# Altium project x_pmu_project.PrjPcb
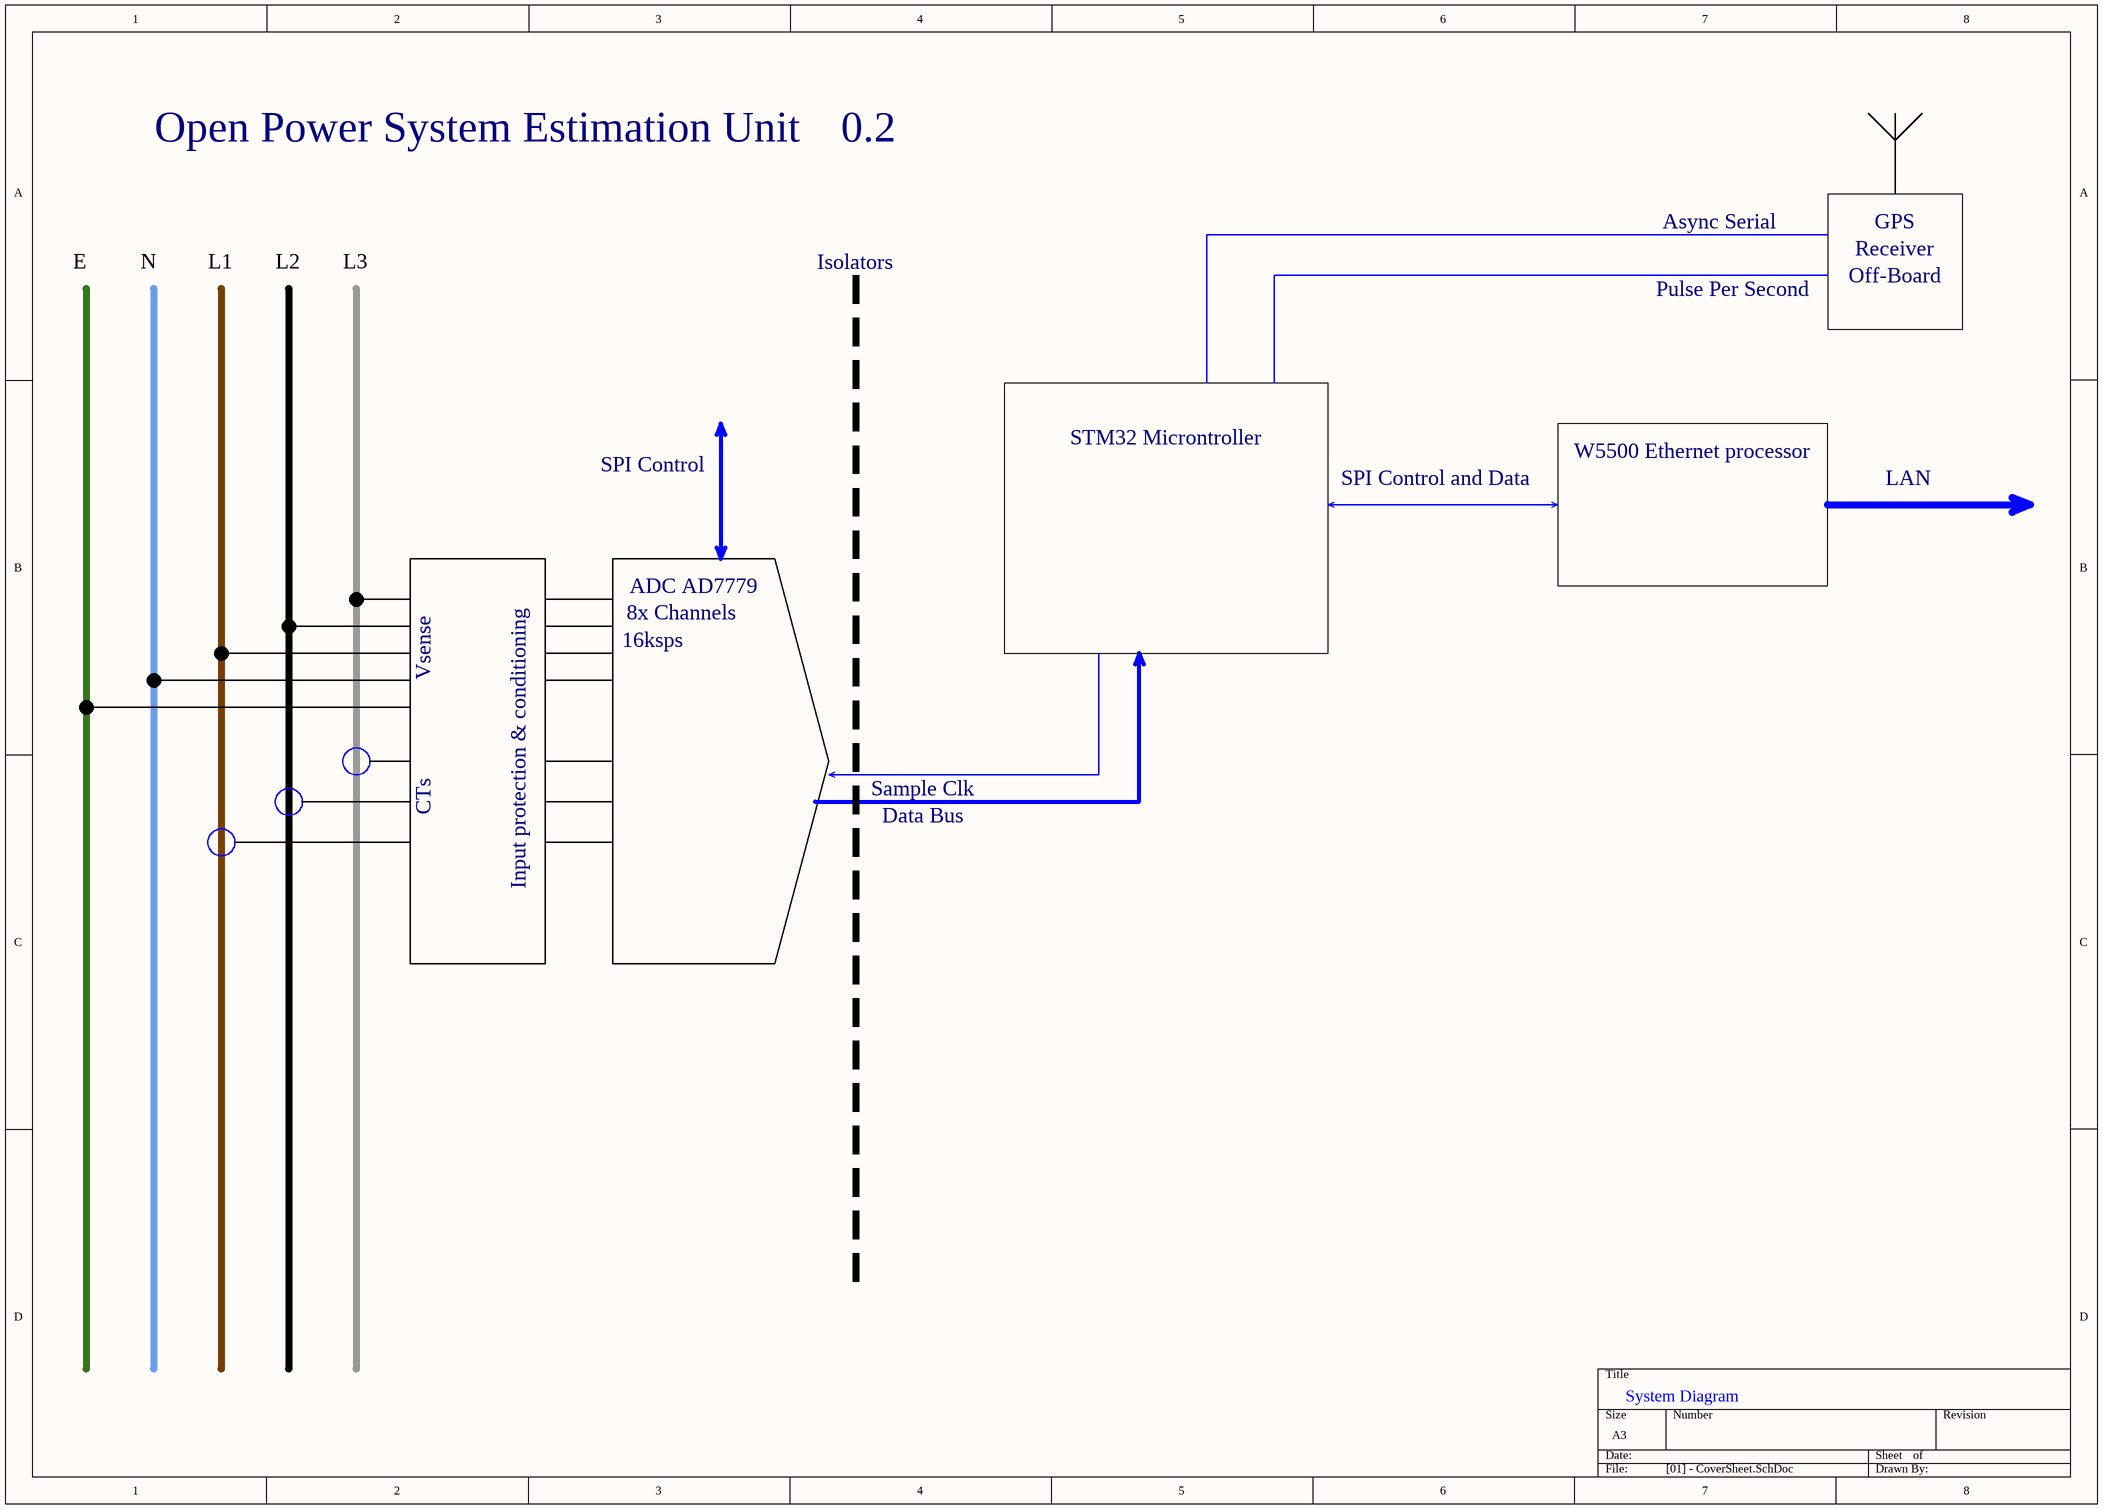
[diagram p0: [01] - CoverSheet.SchDoc]
ProjectName: xPMU
8 sheets, 226 parts. Net scope: flat (ports and power ports of the same name join across sheets).
Board file: x_pmu_board.pcbdoc
Sheets:
  [01] - CoverSheet.SchDoc
  [02] - Notes.SchDoc
  [03] - HV Input.SchDoc
  [04] - Current Transformers.SchDoc
  [05] - ADC.SchDoc
  [08] - Microcontroller.SchDoc
  [09] - Ethernet.SchDoc
  [10] - Isolation.SchDoc

## Sheet [01] - CoverSheet.SchDoc
size A3; Engineer: Derryn Harvie; Revision: 0.2; SheetNumber: 1

### Notes on the sheet
- Open Power System Estimation Unit
- Async Serial
- GPS
- Receiver
- E
- N
- L1
- L2
- L3
- Isolators
- Pulse Per Second
- Off-Board
- STM32 Microntroller
- W5500 Ethernet processor
- SPI Control
- SPI Control and Data
- LAN
- ADC AD7779
- 8x Channels
- 16ksps
- Vsense
- Input protection & conditioning
- Sample Clk
- CTs
- Data Bus
- System Diagram

## Sheet [02] - Notes.SchDoc
size A4
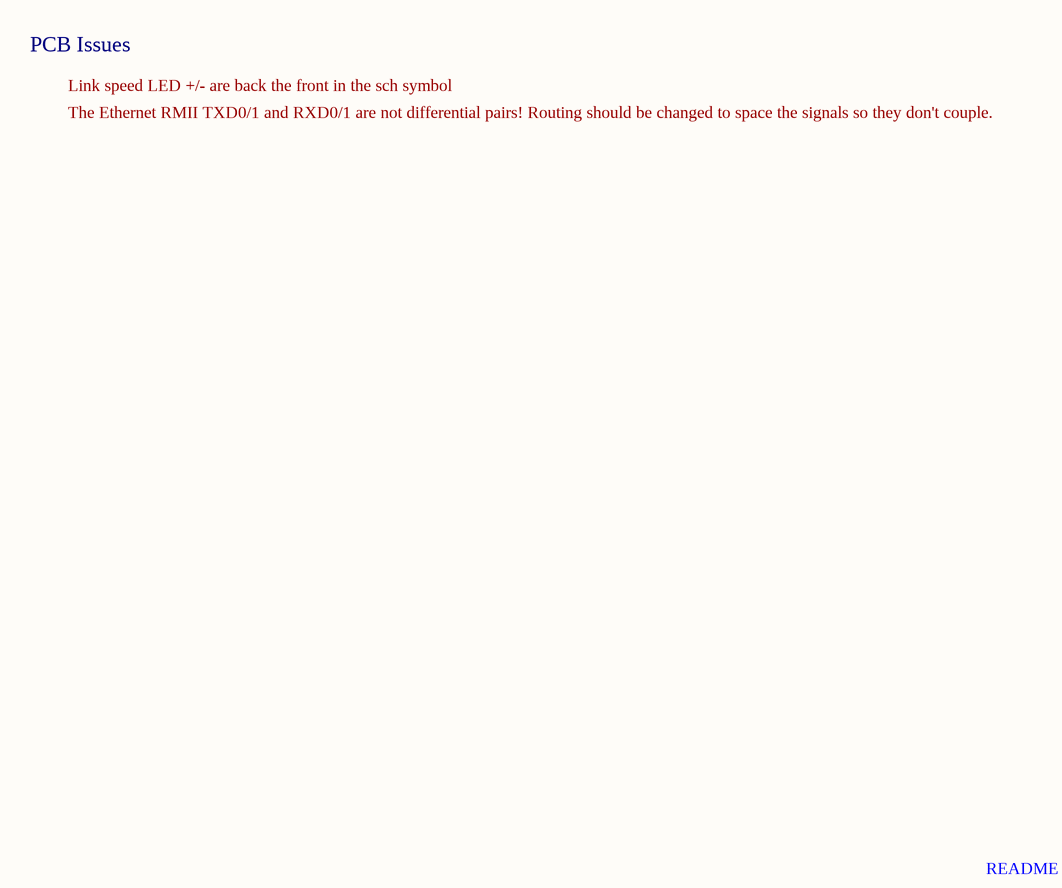
[diagram p1: [02] - Notes.SchDoc]

### Notes on the sheet
- PCB Issues
- Link speed LED +/- are back the front in the sch symbol
- The Ethernet RMII TXD0/1 and RXD0/1 are not differential pairs! Routing should be changed to space the signals so they don't couple.
- README

## Sheet [03] - HV Input.SchDoc
size A3
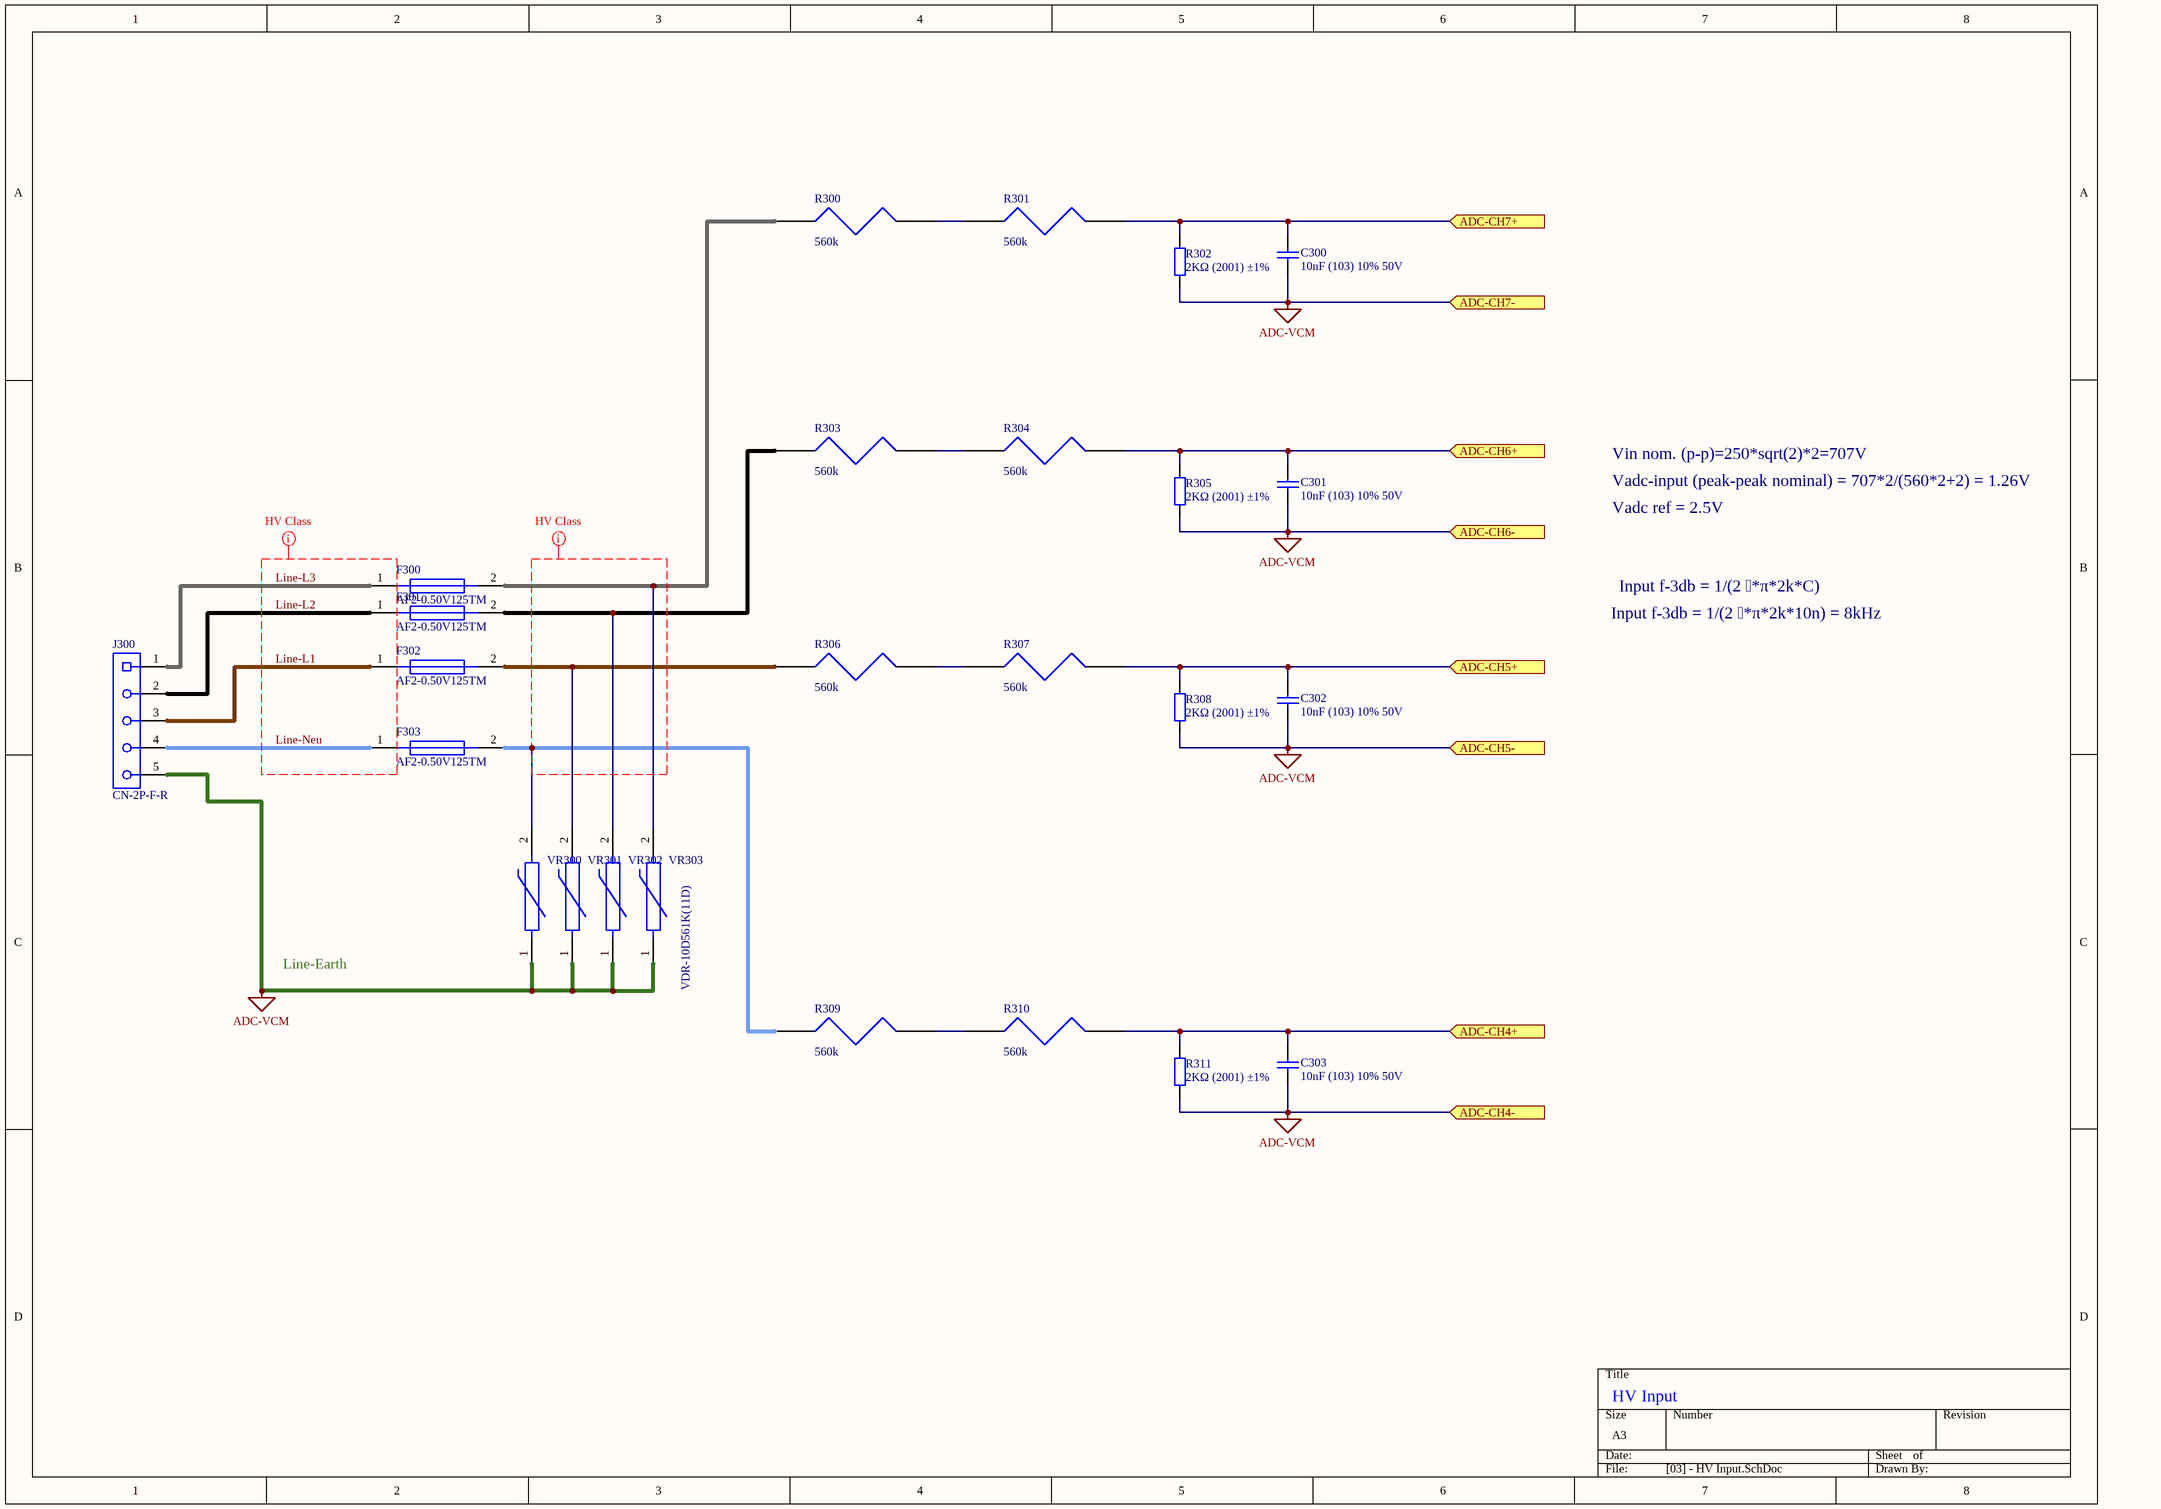
[diagram p2: [03] - HV Input.SchDoc]

### Parts
C300  10nF (103) 10% 50V  [0805_C]
C301  10nF (103) 10% 50V  [0805_C]
C302  10nF (103) 10% 50V  [0805_C]
C303  10nF (103) 10% 50V  [0805_C]
F300  AF2-0.50V125TM  [2410 Fuse]
F301  AF2-0.50V125TM  [2410 Fuse]
F302  AF2-0.50V125TM  [2410 Fuse]
F303  AF2-0.50V125TM  [2410 Fuse]
J300  CN-2P-F-R  [PHOE-1729128-2_V]
R300  560k  [2512_HV_RES]
R301  560k  [2512_HV_RES]
R302  2KΩ (2001) ±1%  [0805_R]
R303  560k  [2512_HV_RES]
R304  560k  [2512_HV_RES]
R305  2KΩ (2001) ±1%  [0805_R]
R306  560k  [2512_HV_RES]
R307  560k  [2512_HV_RES]
R308  2KΩ (2001) ±1%  [0805_R]
R309  560k  [2512_HV_RES]
R310  560k  [2512_HV_RES]
R311  2KΩ (2001) ±1%  [0805_R]
VR300  VDR-10D561K(11D)  [VDR-10D561K(11D)]  (value not drawn)
VR301  VDR-10D561K(11D)  [VDR-10D561K(11D)]  (value not drawn)
VR302  VDR-10D561K(11D)  [VDR-10D561K(11D)]  (value not drawn)
VR303  VDR-10D561K(11D)  [VDR-10D561K(11D)]

### Ports
ADC-CH4+ (in), ADC-CH4- (in), ADC-CH5+ (in), ADC-CH5- (in), ADC-CH6+ (in), ADC-CH6- (in), ADC-CH7+ (in), ADC-CH7- (in)

### Nets
ADC-VCM: C300.1 C301.1 C302.1 C303.1 J300.5 R302.1 R305.1 R308.1 R311.1 VR300.1 VR301.1 VR302.1 VR303.1 ; port ADC-CH4-, port ADC-CH5-, port ADC-CH6-, port ADC-CH7-
Line-L1: F302.1 J300.3
Line-L2: F301.1 J300.2
Line-L3: F300.1 J300.1
Line-Neu: F303.1 J300.4
NetC300_2: C300.2 R301.2 R302.2 ; port ADC-CH7+
NetC301_2: C301.2 R304.2 R305.2 ; port ADC-CH6+
NetC302_2: C302.2 R307.2 R308.2 ; port ADC-CH5+
NetC303_2: C303.2 R310.2 R311.2 ; port ADC-CH4+
NetF300_2: F300.2 R300.1 VR303.2
NetF301_2: F301.2 R303.1 VR302.2
NetF302_2: F302.2 R306.1 VR301.2
NetF303_2: F303.2 R309.1 VR300.2
NetR300_2: R300.2 R301.1
NetR303_2: R303.2 R304.1
NetR306_2: R306.2 R307.1
NetR309_2: R309.2 R310.1

### Layout directives
net class HV: (no net found under the mark), Line-L1, Line-L2, Line-L3, Line-Neu

### Notes on the sheet
- Vin nom. (p-p)=250*sqrt(2)*2=707V
- Vadc-input (peak-peak nominal) = 707*2/(560*2+2) = 1.26V
- Vadc ref = 2.5V
- Input f-3db = 1/(2 *π*2k*C)
- Input f-3db = 1/(2 *π*2k*10n) = 8kHz
- Line-Earth
- HV Input

### Library data of the parts
C300-C303 = 0805 10nF (103) 10% 50V: 贴片电容; ComponentLink1Description: 供应商链接; ComponentLink1URL: http://www.szlcsc.com/product/details_2062.html; Package: 0805; Supplier: LC; SuppliersPartNumber: C1710
F300-F303 = AF2-0.50V125TM: Chip Fuse Fast Blow 500mA 231mΩ 100A AC，50A DC 0.1 2410 Surface Mount Fuses RoHS; SuppliersPartNo: C311009; JLCPCB: NO
J300 = CN-2P-F-R: 5 Way - 10.16 block; JLCPCB: NO
R300 R301 R303 R304 R306 R307 R309 R310 = HR2512F560KE04Z: HIGH VOLTAGE RESISTOR 560KOHMS ±1% 1W 2512 ROHS; Value: 560k; Supplier: LCSC; SuppliersPartNumber: C175529
R302 R305 R308 R311 = 0805 2KΩ (2001) 1%: 贴片电阻; ComponentLink1Description: 供应商链接; ComponentLink1URL: http://www.szlcsc.com/product/details_18292.html; Package: 0805; Supplier: LC; SuppliersPartNumber: C17604
VR300-VR303 = VDR-10D561K(11D): 460V 920V 2.5KA 560V Through Hole Varistors RoHS; SuppliersPartNo: C283943; JLCPCB: NO

## Sheet [04] - Current Transformers.SchDoc
size A3
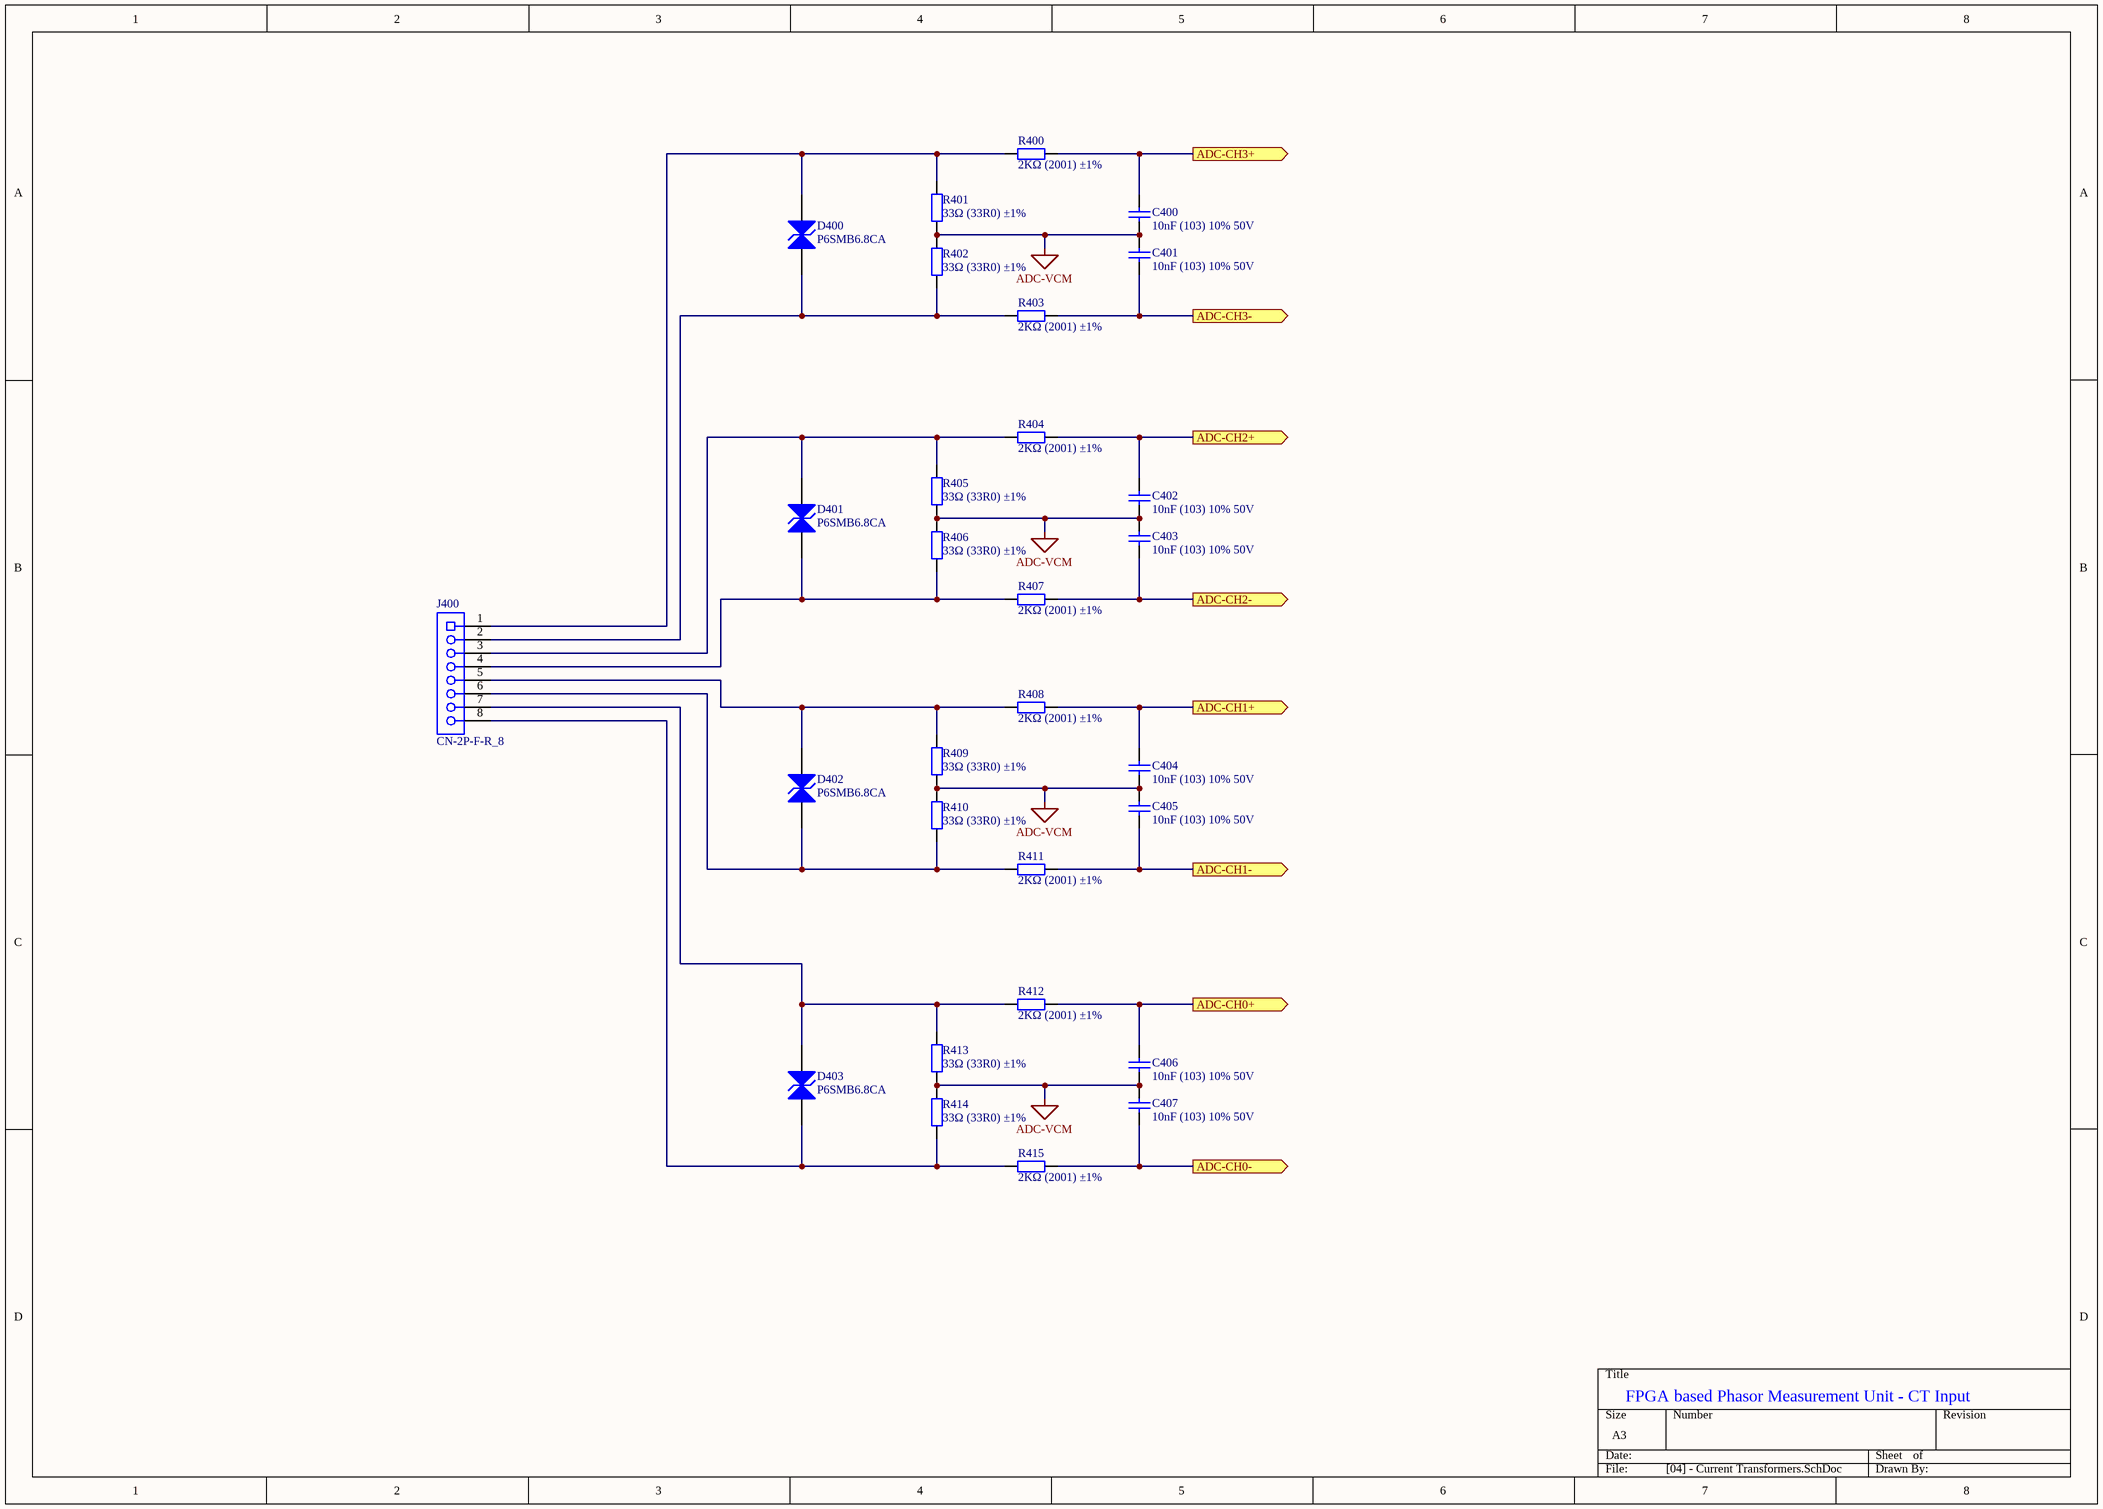
[diagram p3: [04] - Current Transformers.SchDoc]

### Parts
C400  10nF (103) 10% 50V  [0805_C]
C401  10nF (103) 10% 50V  [0805_C]
C402  10nF (103) 10% 50V  [0805_C]
C403  10nF (103) 10% 50V  [0805_C]
C404  10nF (103) 10% 50V  [0805_C]
C405  10nF (103) 10% 50V  [0805_C]
C406  10nF (103) 10% 50V  [0805_C]
C407  10nF (103) 10% 50V  [0805_C]
D400  P6SMB6.8CA  [SMB(DO-214AA)_S1]
D401  P6SMB6.8CA  [SMB(DO-214AA)_S1]
D402  P6SMB6.8CA  [SMB(DO-214AA)_S1]
D403  P6SMB6.8CA  [SMB(DO-214AA)_S1]
J400  CN-2P-F-R_8  [PHOE-8way]
R400  2KΩ (2001) ±1%  [0805_R]
R401  33Ω (33R0) ±1%  [0603_R]
R402  33Ω (33R0) ±1%  [0603_R]
R403  2KΩ (2001) ±1%  [0805_R]
R404  2KΩ (2001) ±1%  [0805_R]
R405  33Ω (33R0) ±1%  [0603_R]
R406  33Ω (33R0) ±1%  [0603_R]
R407  2KΩ (2001) ±1%  [0805_R]
R408  2KΩ (2001) ±1%  [0805_R]
R409  33Ω (33R0) ±1%  [0603_R]
R410  33Ω (33R0) ±1%  [0603_R]
R411  2KΩ (2001) ±1%  [0805_R]
R412  2KΩ (2001) ±1%  [0805_R]
R413  33Ω (33R0) ±1%  [0603_R]
R414  33Ω (33R0) ±1%  [0603_R]
R415  2KΩ (2001) ±1%  [0805_R]

### Ports
ADC-CH0+ (out), ADC-CH0- (out), ADC-CH1+ (out), ADC-CH1- (out), ADC-CH2+ (out), ADC-CH2- (out), ADC-CH3+ (out), ADC-CH3- (out)

### Nets
ADC-VCM: C400.1 C401.2 C402.1 C403.2 C404.1 C405.2 C406.1 C407.2 R401.1 R402.2 R405.1 R406.2 R409.1 R410.2 R413.1 R414.2
NetC400_2: C400.2 R400.1 ; port ADC-CH3+
NetC401_1: C401.1 R403.1 ; port ADC-CH3-
NetC402_2: C402.2 R404.1 ; port ADC-CH2+
NetC403_1: C403.1 R407.1 ; port ADC-CH2-
NetC404_2: C404.2 R408.1 ; port ADC-CH1+
NetC405_1: C405.1 R411.1 ; port ADC-CH1-
NetC406_2: C406.2 R412.1 ; port ADC-CH0+
NetC407_1: C407.1 R415.1 ; port ADC-CH0-
NetD400_1: D400.1(A) J400.2 R402.1 R403.2
NetD400_2: D400.2(K) J400.1 R400.2 R401.2
NetD401_1: D401.1(A) J400.4 R406.1 R407.2
NetD401_2: D401.2(K) J400.3 R404.2 R405.2
NetD402_1: D402.1(A) J400.6 R410.1 R411.2
NetD402_2: D402.2(K) J400.5 R408.2 R409.2
NetD403_1: D403.1(A) J400.8 R414.1 R415.2
NetD403_2: D403.2(K) J400.7 R412.2 R413.2

### Notes on the sheet
- FPGA based Phasor Measurement Unit - CT Input

### Library data of the parts
C400-C407 = 0805 10nF (103) 10% 50V: 贴片电容; ComponentLink1Description: 供应商链接; ComponentLink1URL: http://www.szlcsc.com/product/details_2062.html; Package: 0805; Supplier: LC; SuppliersPartNumber: C1710
D400-D403 = SMB/DO-214AA P6SMB6.8CA: TVS; ComponentLink1Description: 供应商链接; ComponentLink1URL: http://www.szlcsc.com/product/details_79530.html; Package: SMB/DO-214AA; Supplier: LC; SuppliersPartNumber: C78395
J400 = CN-2P-F-R_8: 8way - 5.08 block; JLCPCB: NO
R400 R403 R404 R407 R408 R411 R412 R415 = 0805 2KΩ (2001) 1%: 贴片电阻; ComponentLink1Description: 供应商链接; ComponentLink1URL: http://www.szlcsc.com/product/details_18292.html; Package: 0805; Supplier: LC; SuppliersPartNumber: C17604
R401 R402 R405 R406 R409 R410 R413 R414 = 0603 33Ω (33R0) 1%: 贴片电阻; ComponentLink1Description: 供应商链接; ComponentLink1URL: http://www.szlcsc.com/product/details_23867.html; Package: 0603; Supplier: LC; SuppliersPartNumber: C23140

## Sheet [05] - ADC.SchDoc
size A3
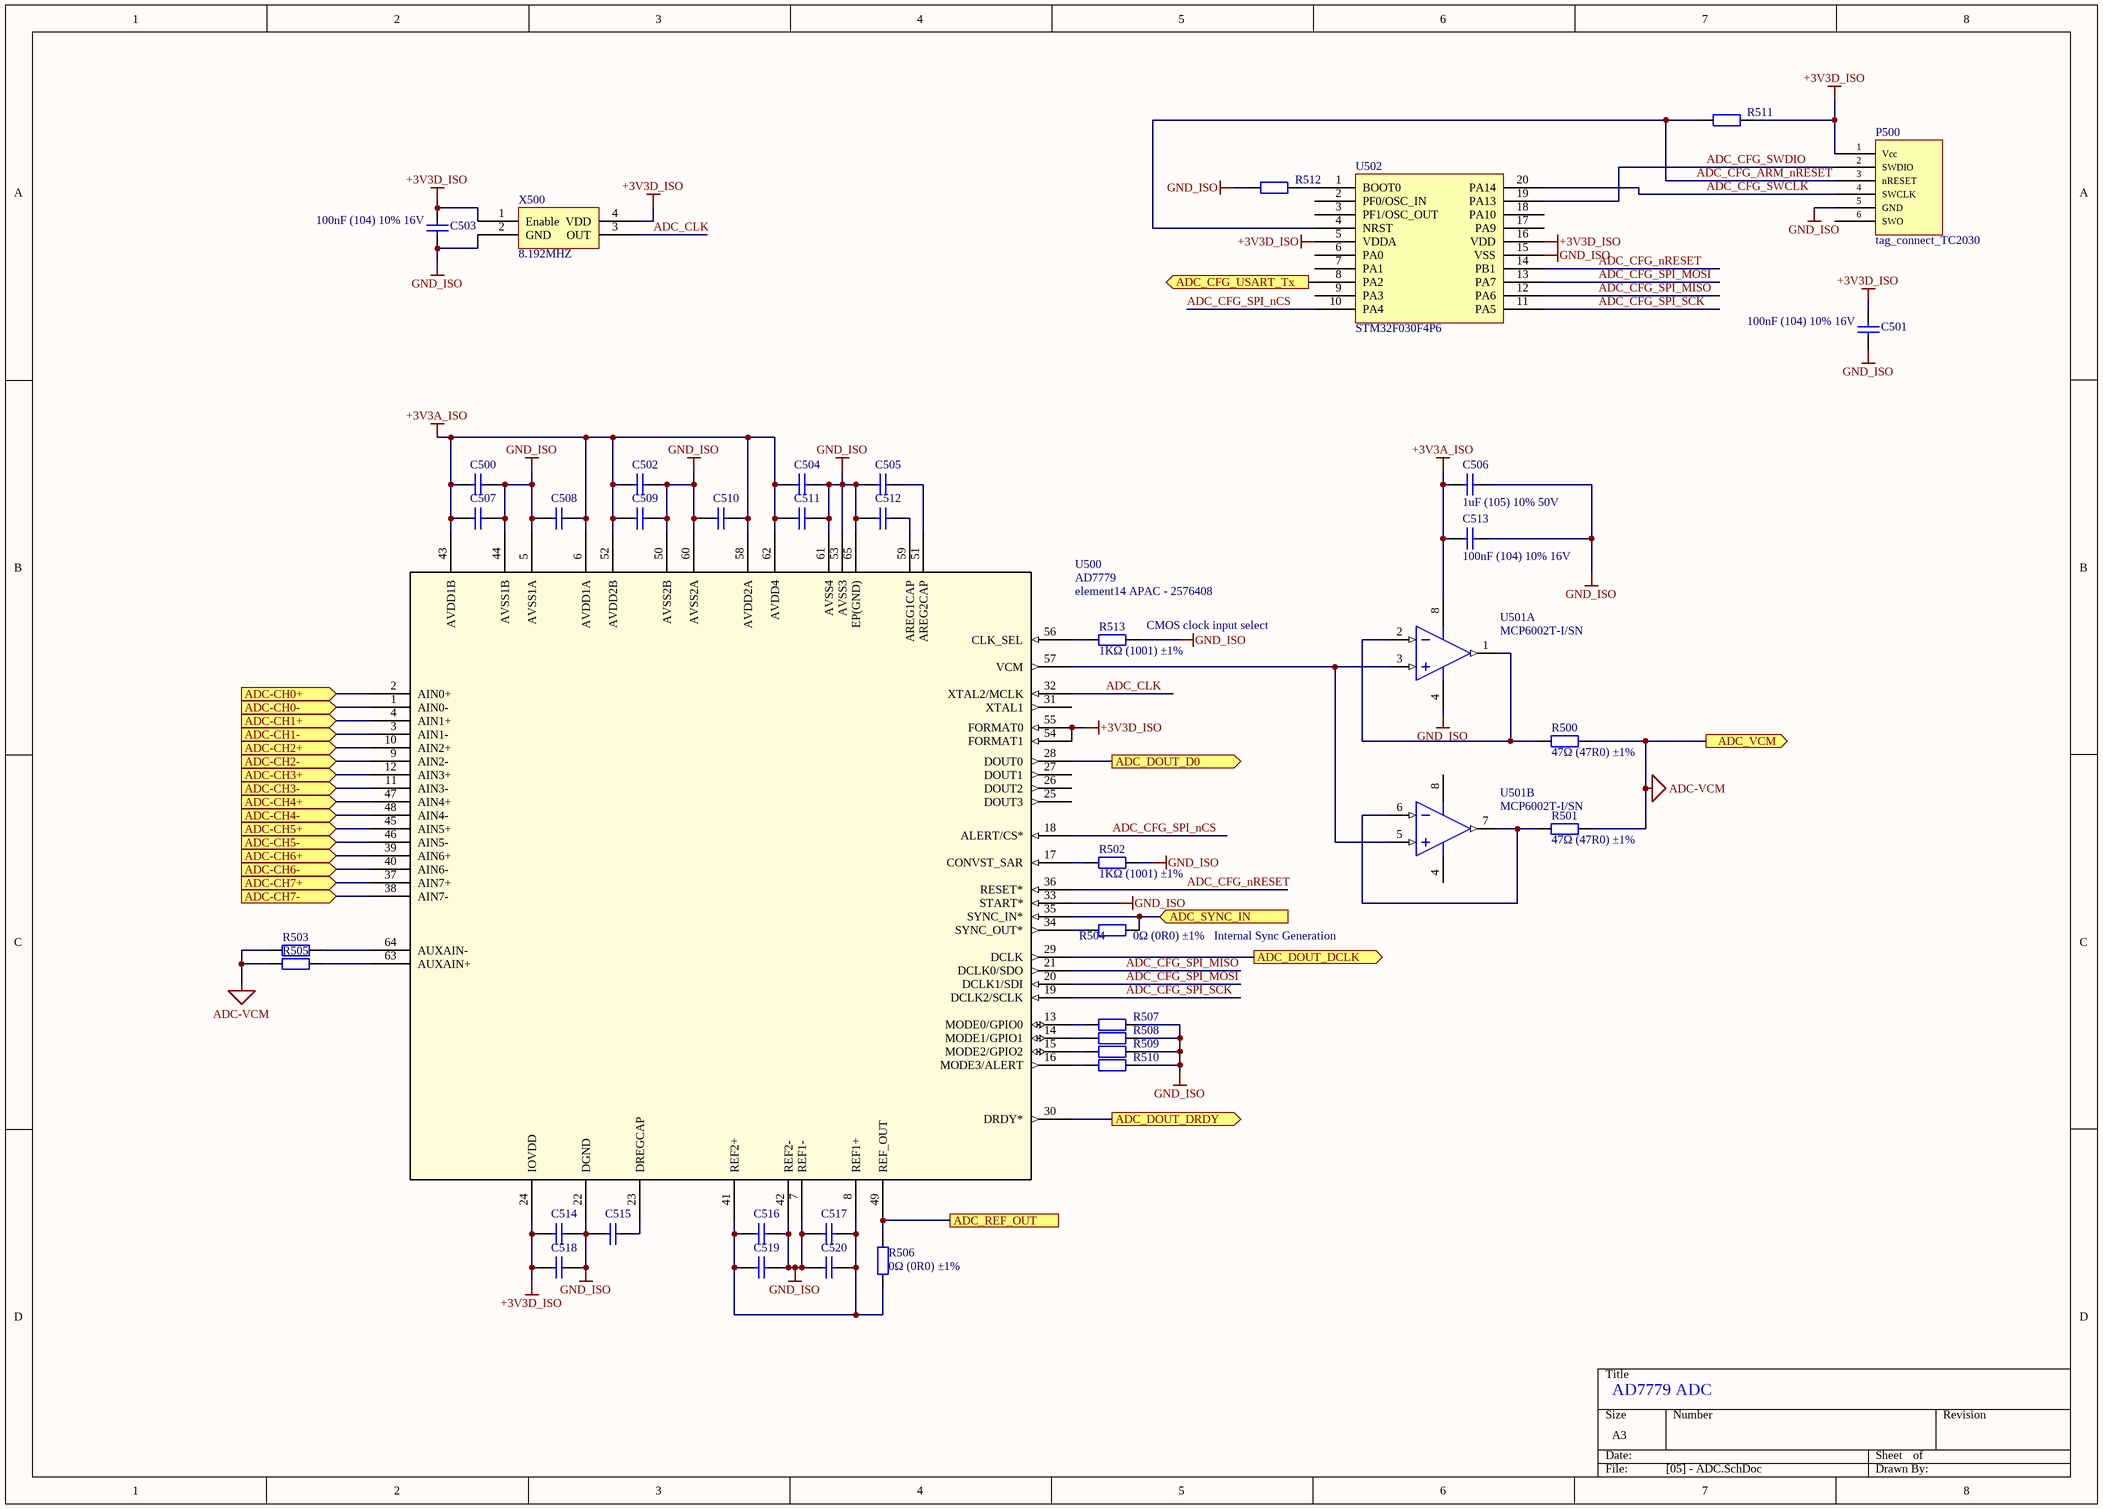
[diagram p4: [05] - ADC.SchDoc]

### Parts
C500  1uF (105) 10% 50V  [0603_C]  (value not drawn)
C501  100nF (104) 10% 16V  [0402_C]
C502  1uF (105) 10% 50V  [0603_C]  (value not drawn)
C503  100nF (104) 10% 16V  [0402_C]
C504  1uF (105) 10% 50V  [0603_C]  (value not drawn)
C505  100nF (104) 10% 16V  [0402_C]  (value not drawn)
C506  1uF (105) 10% 50V  [0603_C]
C507  100nF (104) 10% 16V  [0402_C]  (value not drawn)
C508  100nF (104) 10% 16V  [0402_C]  (value not drawn)
C509  100nF (104) 10% 16V  [0402_C]  (value not drawn)
C510  100nF (104) 10% 16V  [0402_C]  (value not drawn)
C511  100nF (104) 10% 16V  [0402_C]  (value not drawn)
C512  100nF (104) 10% 16V  [0402_C]  (value not drawn)
C513  100nF (104) 10% 16V  [0402_C]
C514  100nF (104) 10% 16V  [0402_C]  (value not drawn)
C515  100nF (104) 10% 16V  [0402_C]  (value not drawn)
C516  100nF (104) 10% 16V  [0402_C]  (value not drawn)
C517  100nF (104) 10% 16V  [0402_C]  (value not drawn)
C518  1uF (105) 10% 50V  [0603_C]  (value not drawn)
C519  1uF (105) 10% 50V  [0603_C]  (value not drawn)
C520  1uF (105) 10% 50V  [0603_C]  (value not drawn)
P500  tag_connect_TC2030  [TC2030-MCP-NL]
R500  47Ω (47R0) ±1%  [0603_R]
R501  47Ω (47R0) ±1%  [0603_R]
R502  1KΩ (1001) ±1%  [0402_R]
R503  1KΩ (1001) ±1%  [0402_R]  (value not drawn)
R504  0Ω (0R0) ±1%  [0402_R]
R505  1KΩ (1001) ±1%  [0402_R]  (value not drawn)
R506  0Ω (0R0) ±1%  [0402_R]
R507  1KΩ (1001) ±1%  [0402_R]  (value not drawn)
R508  1KΩ (1001) ±1%  [0402_R]  (value not drawn)
R509  1KΩ (1001) ±1%  [0402_R]  (value not drawn)
R510  1KΩ (1001) ±1%  [0402_R]  (value not drawn)
R511  1KΩ (1001) ±1%  [0402_R]  (value not drawn)
R512  1KΩ (1001) ±1%  [0402_R]  (value not drawn)
R513  1KΩ (1001) ±1%  [0402_R]
U500  AD7779  Supplier Part Number 1: element14 APAC - 2576408  [CP_64_15]
U501  MCP6002T-I/SN  [SOIC-8_150mil]  (parts A,B of 2)
U502  STM32F030F4P6  [TSSOP-20]
X500  8.192MHZ  [7050 Clock]

### Ports
ADC-CH0+ (in), ADC-CH0- (in), ADC-CH1+ (in), ADC-CH1- (in), ADC-CH2+ (in), ADC-CH2- (in), ADC-CH3+ (in), ADC-CH3- (in), ADC-CH4+ (in), ADC-CH4- (in), ADC-CH5+ (in), ADC-CH5- (in), ADC-CH6+ (in), ADC-CH6- (in), ADC-CH7+ (in), ADC-CH7- (in), ADC_CFG_USART_Tx (out), ADC_DOUT_D0 (out), ADC_DOUT_DCLK (out), ADC_DOUT_DRDY (out), ADC_REF_OUT, ADC_SYNC_IN (in), ADC_VCM (out)

### Nets
+3V3A_ISO: C500.1 C502.1 C504.1 C506.1 C507.1 C508.2 C509.1 C510.2 C511.1 C513.1 U500.6(AVDD1A) U500.43(AVDD1B) U500.52(AVDD2B) U500.58(AVDD2A) U500.62(AVDD4) U501.8(VDD)
+3V3D_ISO: C501.2 C503.2 C514.1 C518.1 P500.1(Vcc) R511.2 U500.24(IOVDD) U500.54(FORMAT1) U500.55(FORMAT0) U502.5(VDDA) U502.16(VDD) X500.1(Enable) X500.4(VDD)
ADC-VCM: R500.2 R501.2 R503.1 R505.1 U500.38(AIN7-) U500.40(AIN6-) U500.46(AIN5-) U500.48(AIN4-) ; port ADC_VCM, port ADC-CH4-, port ADC-CH5-, port ADC-CH6-, port ADC-CH7-
GND_ISO: C500.2 C501.1 C502.2 C503.1 C504.2 C505.1 C506.2 C507.2 C508.1 C509.2 C510.1 C511.2 C512.1 C513.2 C514.2 C515.1 C516.2 C517.1 C518.2 C519.2 C520.1 P500.5(GND) R502.2 R507.2 R508.2 R509.2 R510.2 R512.1 R513.2 U500.5(AVSS1A) U500.7(REF1-) U500.22(DGND) U500.33(START*) U500.42(REF2-) U500.44(AVSS1B) U500.50(AVSS2B) U500.53(AVSS3) U500.60(AVSS2A) U500.61(AVSS4) U500.65(EP(GND)) U501.4(VSS) U502.15(VSS) X500.2(GND)
ADC_CFG_ARM_nRESET: P500.3(nRESET) R511.1 U502.4(NRST)
ADC_CFG_nRESET: U500.36(RESET*) U502.14(PB1)
ADC_CFG_SPI_MISO: U500.21(DCLK0/SDO) U502.12(PA6)
ADC_CFG_SPI_MOSI: U500.20(DCLK1/SDI) U502.13(PA7)
ADC_CFG_SPI_nCS: U500.18(ALERT/CS*) U502.10(PA4)
ADC_CFG_SPI_SCK: U500.19(DCLK2/SCLK) U502.11(PA5)
ADC_CFG_SWCLK: P500.4(SWCLK) U502.20(PA14)
ADC_CFG_SWDIO: P500.2(SWDIO) U502.19(PA13)
ADC_CLK: U500.32(XTAL2/MCLK) X500.3(OUT)
NetC300_2: U500.37(AIN7+) ; port ADC-CH7+
NetC301_2: U500.39(AIN6+) ; port ADC-CH6+
NetC302_2: U500.45(AIN5+) ; port ADC-CH5+
NetC303_2: U500.47(AIN4+) ; port ADC-CH4+
NetC400_2: U500.12(AIN3+) ; port ADC-CH3+
NetC401_1: U500.11(AIN3-) ; port ADC-CH3-
NetC402_2: U500.10(AIN2+) ; port ADC-CH2+
NetC403_1: U500.9(AIN2-) ; port ADC-CH2-
NetC404_2: U500.4(AIN1+) ; port ADC-CH1+
NetC405_1: U500.3(AIN1-) ; port ADC-CH1-
NetC406_2: U500.2(AIN0+) ; port ADC-CH0+
NetC407_1: U500.1(AIN0-) ; port ADC-CH0-
NetC505_2: C505.2 U500.51(AREG2CAP)
NetC512_2: C512.2 U500.59(AREG1CAP)
NetC515_2: C515.2 U500.23(DREGCAP)
NetC516_1: C516.1 C517.2 C519.1 C520.2 R506.1 U500.8(REF1+) U500.41(REF2+)
NetR500_1: R500.1 U501.1(VOUTA) U501.2(VINA-)
NetR501_1: R501.1 U501.6(VINB-) U501.7(VOUTB)
NetR502_1: R502.1 U500.17(CONVST_SAR)
NetR503_2: R503.2 U500.64(AUXAIN-)
NetR504_1: R504.1 U500.34(SYNC_OUT*)
NetR504_2: R504.2 U500.35(SYNC_IN*) ; port ADC_SYNC_IN
NetR505_2: R505.2 U500.63(AUXAIN+)
NetR506_2: R506.2 U500.49(REF_OUT) ; port ADC_REF_OUT
NetR507_1: R507.1 U500.13(MODE0/GPIO0)
NetR508_1: R508.1 U500.14(MODE1/GPIO1)
NetR509_1: R509.1 U500.15(MODE2/GPIO2)
NetR510_1: R510.1 U500.16(MODE3/ALERT)
NetR512_2: R512.2 U502.1(BOOT0)
NetR513_1: R513.1 U500.56(CLK_SEL)
NetU100_3: U502.8(PA2) ; port ADC_CFG_USART_Tx
NetU100_4: U500.30(DRDY*) ; port ADC_DOUT_DRDY
NetU100_5: U500.29(DCLK) ; port ADC_DOUT_DCLK
NetU100_6: U500.28(DOUT0) ; port ADC_DOUT_D0
NetU500_57: U500.57(VCM) U501.3(VINA+) U501.5(VINB+)

Not connected (* = marked no-connect by the designer): P500 6(SWO); U500 25(DOUT3) 26(DOUT2) 27(DOUT1) 31(XTAL1); U502 2(PF0/OSC_IN) 3(PF1/OSC_OUT) 6(PA0) 7(PA1) 9(PA3) 17(PA9) 18(PA10)

### Notes on the sheet
- (near R513) CMOS clock input select
- Internal Sync Generation
- AD7779 ADC

### Library data of the parts
C500 C502 C504 C506 C518-C520 = 0603 1uF (105) 10% 50V: 贴片电容; ComponentLink1Description: 供应商链接; ComponentLink1URL: http://www.szlcsc.com/product/details_16531.html; Package: 0603; Supplier: LC; SuppliersPartNumber: C15849
C501 C503 C505 C507-C517 = 0402 100nF (104) 10% 16V: 贴片电容; ComponentLink1Description: 供应商链接; ComponentLink1URL: http://www.szlcsc.com/product/details_1877.html; Package: 0402; Supplier: LC; SuppliersPartNumber: C1525
R500 R501 = 0603 47Ω (47R0) 1%: 贴片电阻; ComponentLink1Description: 供应商链接; ComponentLink1URL: http://www.szlcsc.com/product/details_23909.html; Package: 0603; Supplier: LC; SuppliersPartNumber: C23182
R502 R503 R505 R507-R513 = 0402 1KΩ (1001) 1%: 贴片电阻; ComponentLink1Description: 供应商链接; ComponentLink1URL: http://www.szlcsc.com/product/details_12256.html; Package: 0402; Supplier: LC; SuppliersPartNumber: C11702
R504 R506 = 0402 0Ω (0R0) 1%: 贴片电阻; ComponentLink1Description: 供应商链接; ComponentLink1URL: http://www.szlcsc.com/product/details_17853.html; Package: 0402; Supplier: LC; SuppliersPartNumber: C17168
U500 = AD7779ACPZ: ADC - 8 Channel; Supplier 1: Octopart; JLCPCB: NO
U501 = MCP6002T-I/SN_[C7377]: 运放; ComponentLink1Description: 供应商链接; ComponentLink1URL: http://www.szlcsc.com/product/details_7854.html; Package: SOIC-8_150mil; Supplier: LC; SuppliersPartNumber: C7377
U502 = STM32F030F4P6: ARM; ComponentLink1Description: 供应商链接; ComponentLink1URL: http://www.szlcsc.com/product/details_33873.html; Package: TSSOP-20; Supplier: LC; SuppliersPartNumber: C32908
X500 = O70508192MGDA4SC-1: SMD OSCILLATORS(XO) 8.192MHZ ±20PPM SMD-7050_4P ROHS; SuppliersPartNumber: C70640
P500 = tag_connect_TC2030: JLCPCB: NO

## Sheet [08] - Microcontroller.SchDoc
size A3
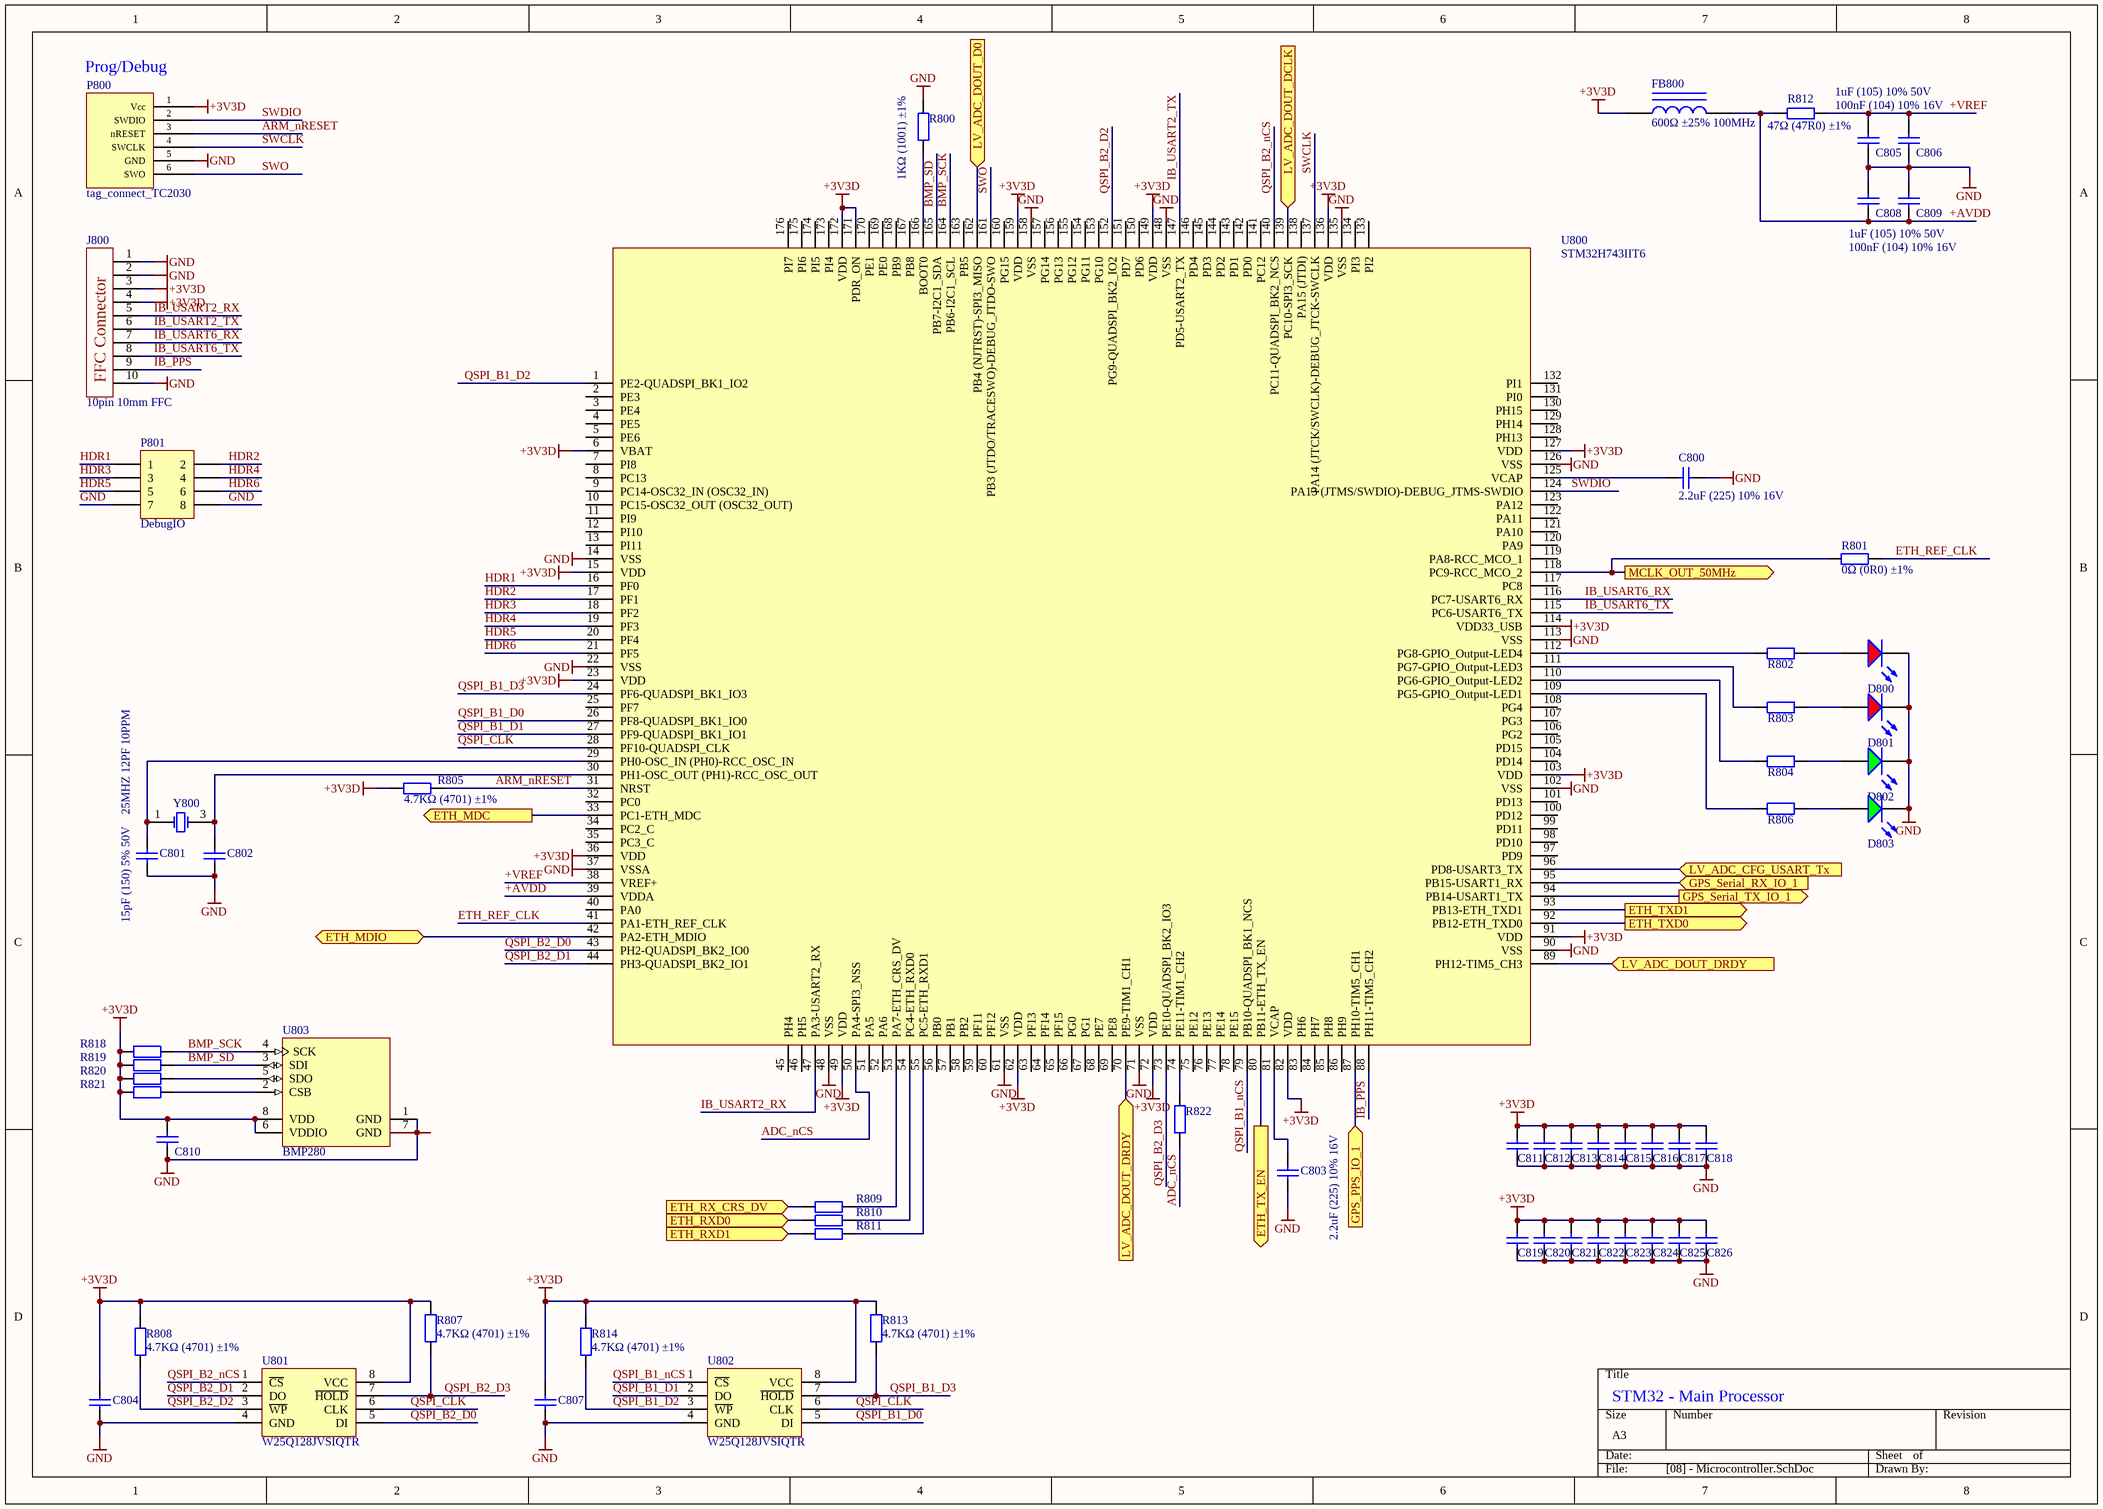
[diagram p5: [08] - Microcontroller.SchDoc]

### Parts
C800  2.2uF (225) 10% 16V  [0603_C]
C801  15pF (150) 5% 50V  [0402_C]
C802  15pF (150) 5% 50V  [0402_C]  (value not drawn)
C803  2.2uF (225) 10% 16V  [0603_C]
C804  100nF (104) 10% 16V  [0402_C]  (value not drawn)
C805  1uF (105) 10% 50V  [0603_C]
C806  100nF (104) 10% 16V  [0402_C]
C807  100nF (104) 10% 16V  [0402_C]  (value not drawn)
C808  1uF (105) 10% 50V  [0603_C]
C809  100nF (104) 10% 16V  [0402_C]
C810  100nF (104) 10% 16V  [0402_C]  (value not drawn)
C811  100nF (104) 10% 16V  [0402_C]  (value not drawn)
C812  100nF (104) 10% 16V  [0402_C]  (value not drawn)
C813  100nF (104) 10% 16V  [0402_C]  (value not drawn)
C814  100nF (104) 10% 16V  [0402_C]  (value not drawn)
C815  100nF (104) 10% 16V  [0402_C]  (value not drawn)
C816  100nF (104) 10% 16V  [0402_C]  (value not drawn)
C817  100nF (104) 10% 16V  [0402_C]  (value not drawn)
C818  100nF (104) 10% 16V  [0402_C]  (value not drawn)
C819  100nF (104) 10% 16V  [0402_C]  (value not drawn)
C820  100nF (104) 10% 16V  [0402_C]  (value not drawn)
C821  100nF (104) 10% 16V  [0402_C]  (value not drawn)
C822  100nF (104) 10% 16V  [0402_C]  (value not drawn)
C823  100nF (104) 10% 16V  [0402_C]  (value not drawn)
C824  100nF (104) 10% 16V  [0402_C]  (value not drawn)
C825  100nF (104) 10% 16V  [0402_C]  (value not drawn)
C826  100nF (104) 10% 16V  [0402_C]  (value not drawn)
D800  红灯 0603  [0603_LED_S1]  (value not drawn)
D801  红灯 0603  [0603_LED_S1]  (value not drawn)
D802  绿灯 0603  [0603_LED_S1]  (value not drawn)
D803  绿灯 0603  [0603_LED_S1]  (value not drawn)
FB800  600Ω ±25% 100MHz  [0805_L]
J800  10pin 10mm FFC  [AFA07-S10FCC-00]
P800  tag_connect_TC2030  [TC2030-MCP-NL]
P801  DebugIO  [HDR2X4]
R800  1KΩ (1001) ±1%  [0402_R]
R801  0Ω (0R0) ±1%  [0402_R]
R802  150Ω (1500) ±1%  [0402_R]  (value not drawn)
R803  150Ω (1500) ±1%  [0402_R]  (value not drawn)
R804  150Ω (1500) ±1%  [0402_R]  (value not drawn)
R805  4.7KΩ (4701) ±1%  [0402_R]
R806  150Ω (1500) ±1%  [0402_R]  (value not drawn)
R807  4.7KΩ (4701) ±1%  [0402_R]
R808  4.7KΩ (4701) ±1%  [0402_R]
R809  49.9Ω (49R9) ±1%  [0402_R]  (value not drawn)
R810  49.9Ω (49R9) ±1%  [0402_R]  (value not drawn)
R811  49.9Ω (49R9) ±1%  [0402_R]  (value not drawn)
R812  47Ω (47R0) ±1%  [0402_R]
R813  4.7KΩ (4701) ±1%  [0402_R]
R814  4.7KΩ (4701) ±1%  [0402_R]
R818  4.7KΩ (4701) ±1%  [0402_R]  (value not drawn)
R819  4.7KΩ (4701) ±1%  [0402_R]  (value not drawn)
R820  4.7KΩ (4701) ±1%  [0402_R]  (value not drawn)
R821  4.7KΩ (4701) ±1%  [0402_R]  (value not drawn)
R822  0Ω (0R0) ±1%  [0402_R]  (value not drawn)
U800  STM32H743IIT6  [Quad176]
U801  W25Q128JVSIQTR  [SOIC-8_208mil]
U802  W25Q128JVSIQTR  [SOIC-8_208mil]
U803  BMP280  [BOSC-LGA-8_V_LARGE]
Y800  25MHZ 12PF 10PPM  [SMD-3225_4P]

### Ports
ETH_MDC (out), ETH_MDIO (bidir), ETH_RX_CRS_DV (in), ETH_RXD0 (in), ETH_RXD1 (in), ETH_TX_EN (out), ETH_TXD0 (out), ETH_TXD1 (out), GPS_PPS_IO_1 (in), GPS_Serial_RX_IO_1 (in), GPS_Serial_TX_IO_1 (out), LV_ADC_CFG_USART_Tx (in), LV_ADC_DOUT_D0 (in), LV_ADC_DOUT_DCLK (in), LV_ADC_DOUT_DRDY (in), MCLK_OUT_50MHz (out)

### Nets
+3V3D: C804.2 C807.2 C810.2 C811.2 C812.2 C813.2 C814.2 C815.2 C816.2 C817.2 C818.2 C819.2 C820.2 C821.2 C822.2 C823.2 C824.2 C825.2 C826.2 FB800.1 J800.3 J800.4 P800.1(Vcc) R805.2 R807.2 R808.1 R813.2 R814.1 R818.1 R819.1 R820.1 R821.1 U800.6(VBAT) U800.15(VDD) U800.23(VDD) U800.36(VDD) U800.49(VDD) U800.62(VDD) U800.72(VDD) U800.82(VDD) U800.91(VDD) U800.103(VDD) U800.114(VDD33_USB) U800.127(VDD) U800.136(VDD) U800.149(VDD) U800.159(VDD) U800.171(PDR_ON) U800.172(VDD) U801.8(VCC) U802.8(VCC) U803.6(VDDIO) U803.8(VDD)
GND: C800.2 C801.1 C802.1 C803.2 C804.1 C805.1 C806.1 C807.1 C808.2 C809.2 C810.1 C811.1 C812.1 C813.1 C814.1 C815.1 C816.1 C817.1 C818.1 C819.1 C820.1 C821.1 C822.1 C823.1 C824.1 C825.1 C826.1 D800.K D801.K D802.K D803.K J800.1 J800.2 J800.10 P800.5(GND) P801.7 P801.8 R800.2 U800.14(VSS) U800.22(VSS) U800.37(VSSA) U800.48(VSS) U800.61(VSS) U800.71(VSS) U800.90(VSS) U800.102(VSS) U800.113(VSS) U800.126(VSS) U800.135(VSS) U800.148(VSS) U800.158(VSS) U801.4(GND) U802.4(GND) U803.1(GND) U803.7(GND)
+AVDD: C808.1 C809.1 FB800.2 R812.1 U800.39(VDDA)
+VREF: C805.2 C806.2 R812.2 U800.38(VREF+)
ADC_nCS: R822.1 U800.50(PA4-SPI3_NSS)
ARM_nRESET: P800.3(nRESET) R805.1 U800.31(NRST)
BMP_SCK: R818.2 U800.164(PB6-I2C1_SCL) U803.4(SCK)
BMP_SD: R819.2 U800.165(PB7-I2C1_SDA) U803.3(SDI)
ETH_REF_CLK: R801.2 U800.41(PA1-ETH_REF_CLK)
HDR1: P801.1 U800.16(PF0)
HDR2: P801.2 U800.17(PF1)
HDR3: P801.3 U800.18(PF2)
HDR4: P801.4 U800.19(PF3)
HDR5: P801.5 U800.20(PF4)
HDR6: P801.6 U800.21(PF5)
IB_PPS: J800.9 U800.88(PH11-TIM5_CH2)
IB_USART2_RX: J800.5 U800.47(PA3-USART2_RX)
IB_USART2_TX: J800.6 U800.147(PD5-USART2_TX)
IB_USART6_RX: J800.7 U800.116(PC7-USART6_RX)
IB_USART6_TX: J800.8 U800.115(PC6-USART6_TX)
QSPI_B1_D0: U800.26(PF8-QUADSPI_BK1_IO0) U802.5(DI)
QSPI_B1_D1: U800.27(PF9-QUADSPI_BK1_IO1) U802.2(DO)
QSPI_B1_D2: R814.2 U800.1(PE2-QUADSPI_BK1_IO2) U802.3(~{WP})
QSPI_B1_D3: R813.1 U800.24(PF6-QUADSPI_BK1_IO3) U802.7(~{HOLD})
QSPI_B1_nCS: U800.79(PB10-QUADSPI_BK1_NCS) U802.1(~{CS})
QSPI_B2_D0: U800.43(PH2-QUADSPI_BK2_IO0) U801.5(DI)
QSPI_B2_D1: U800.44(PH3-QUADSPI_BK2_IO1) U801.2(DO)
QSPI_B2_D2: R808.2 U800.152(PG9-QUADSPI_BK2_IO2) U801.3(~{WP})
QSPI_B2_D3: R807.1 U800.73(PE10-QUADSPI_BK2_IO3) U801.7(~{HOLD})
QSPI_B2_nCS: U800.140(PC11-QUADSPI_BK2_NCS) U801.1(~{CS})
QSPI_CLK: U800.28(PF10-QUADSPI_CLK) U801.6(CLK) U802.6(CLK)
SWCLK: P800.4(SWCLK) U800.137(PA14_(JTCK/SWCLK)-DEBUG_JTCK-SWCLK)
SWDIO: P800.2(SWDIO) U800.124(PA13_(JTMS/SWDIO)-DEBUG_JTMS-SWDIO)
SWO: P800.6(SWO) U800.161(PB3_(JTDO/TRACESWO)-DEBUG_JTDO-SWO)
NetC800_1: C800.1 U800.125(VCAP)
NetC801_2: C801.2 U800.29(PH0-OSC_IN_(PH0)-RCC_OSC_IN) Y800.1(OSC1)
NetC802_2: C802.2 U800.30(PH1-OSC_OUT_(PH1)-RCC_OSC_OUT) Y800.3(OSC2)
NetC803_1: C803.1 U800.81(VCAP)
NetD800_A: D800.A R802.1
NetD801_A: D801.A R803.1
NetD802_A: D802.A R804.1
NetD803_A: D803.A R806.1
NetR101_1: U800.95(PB15-USART1_RX) ; port GPS_Serial_RX_IO_1
NetR102_1: U800.94(PB14-USART1_TX) ; port GPS_Serial_TX_IO_1
NetR104_1: U800.87(PH10-TIM5_CH1) ; port GPS_PPS_IO_1
NetR800_1: R800.1 U800.166(BOOT0)
NetR801_1: R801.1 U800.118(PC9-RCC_MCO_2) ; port MCLK_OUT_50MHz
NetR802_2: R802.2 U800.112(PG8-GPIO_Output-LED4)
NetR803_2: R803.2 U800.111(PG7-GPIO_Output-LED3)
NetR804_2: R804.2 U800.110(PG6-GPIO_Output-LED2)
NetR806_2: R806.2 U800.109(PG5-GPIO_Output-LED1)
NetR809_1: R809.1 ; port ETH_RX_CRS_DV
NetR809_2: R809.2 U800.53(PA7-ETH_CRS_DV)
NetR810_1: R810.1 ; port ETH_RXD0
NetR810_2: R810.2 U800.54(PC4-ETH_RXD0)
NetR811_1: R811.1 ; port ETH_RXD1
NetR811_2: R811.2 U800.55(PC5-ETH_RXD1)
NetR820_2: R820.2 U803.5(SDO)
NetR821_2: R821.2 U803.2(CSB)
NetR822_2: R822.2 U800.74(PE11-TIM1_CH2)
NetR900_1: U800.80(PB11-ETH_TX_EN) ; port ETH_TX_EN
NetR901_1: U800.92(PB12-ETH_TXD0) ; port ETH_TXD0
NetR902_1: U800.93(PB13-ETH_TXD1) ; port ETH_TXD1
NetU100_11: U800.162(PB4_(NJTRST)-SPI3_MISO) ; port LV_ADC_DOUT_D0
NetU100_12: U800.139(PC10-SPI3_SCK) ; port LV_ADC_DOUT_DCLK
NetU100_13: U800.70(PE9-TIM1_CH1) U800.89(PH12-TIM5_CH3) ; port LV_ADC_DOUT_DRDY
NetU100_14: U800.96(PD8-USART3_TX) ; port LV_ADC_CFG_USART_Tx
NetU800_33: U800.33(PC1-ETH_MDC) ; port ETH_MDC
NetU800_42: U800.42(PA2-ETH_MDIO) ; port ETH_MDIO

Not connected (* = marked no-connect by the designer): U800 2(PE3) 3(PE4) 4(PE5) 5(PE6) 7(PI8) 8(PC13) 9(PC14-OSC32_IN_(OSC32_IN)) 10(PC15-OSC32_OUT_(OSC32_OUT)) 11(PI9) 12(PI10) 13(PI11) 25(PF7) 32(PC0) 34(PC2_C) 35(PC3_C) 40(PA0) 45(PH4) 46(PH5) 51(PA5) 52(PA6) 56(PB0) 57(PB1) 58(PB2) 59(PF11) 60(PF12) 63(PF13) 64(PF14) 65(PF15) 66(PG0) 67(PG1) 68(PE7) 69(PE8) 75(PE12) 76(PE13) 77(PE14) 78(PE15) 83(PH6) 84(PH7) 85(PH8) 86(PH9) 97(PD9) 98(PD10) 99(PD11) 100(PD12) 101(PD13) 104(PD14) 105(PD15) 106(PG2) 107(PG3) 108(PG4) 117(PC8) 119(PA8-RCC_MCO_1) 120(PA9) 121(PA10) 122(PA11) 123(PA12) 128(PH13) 129(PH14) 130(PH15) 131(PI0) 132(PI1) 133(PI2) 134(PI3) 138(PA15_(JTDI)) 141(PC12) 142(PD0) 143(PD1) 144(PD2) 145(PD3) 146(PD4) 150(PD6) 151(PD7) 153(PG10) 154(PG11) 155(PG12) 156(PG13) 157(PG14) 160(PG15) 163(PB5) 167(PB8) 168(PB9) 169(PE0) 170(PE1) 173(PI4) 174(PI5) 175(PI6) 176(PI7)

### Notes on the sheet
- (near P800) Prog/Debug
- STM32 - Main Processor
- (in symbol AFA07-S10FCC-00) FFC Connector

### Library data of the parts
C800 C803 = 0603 2.2uF (225) 10% 16V: 贴片电容; ComponentLink1Description: 供应商链接; ComponentLink1URL: http://www.szlcsc.com/product/details_24366.html; Package: 0603; Supplier: LC; SuppliersPartNumber: C23630
C801 C802 = 0402 15pF (150) 5% 50V: 贴片电容; ComponentLink1Description: 供应商链接; ComponentLink1URL: http://www.szlcsc.com/product/details_1900.html; Package: 0402; Supplier: LC; SuppliersPartNumber: C1548
C804 C806 C807 C809-C826 = 0402 100nF (104) 10% 16V: 贴片电容; ComponentLink1Description: 供应商链接; ComponentLink1URL: http://www.szlcsc.com/product/details_1877.html; Package: 0402; Supplier: LC; SuppliersPartNumber: C1525
C805 C808 = 0603 1uF (105) 10% 50V: 贴片电容; ComponentLink1Description: 供应商链接; ComponentLink1URL: http://www.szlcsc.com/product/details_16531.html; Package: 0603; Supplier: LC; SuppliersPartNumber: C15849
D800 D801 = 0603 红灯: 发光二极管; ComponentLink1Description: 供应商链接; ComponentLink1URL: http://www.szlcsc.com/product/details_2659.html; Package: 0603; Supplier: LC; SuppliersPartNumber: C2286
D802 D803 = 0603 绿灯: 发光二极管; ComponentLink1Description: 供应商链接; ComponentLink1URL: http://www.szlcsc.com/product/details_73152.html; Package: 0603; Supplier: LC; SuppliersPartNumber: C72043
FB800 = 0805 600Ω 25% 100MHz: 贴片磁珠; ComponentLink1Description: 供应商链接; ComponentLink1URL: http://www.szlcsc.com/product/details_1369.html; Package: 0805; Supplier: LC; SuppliersPartNumber: C1017
J800 = AFA07-S10FCC-00: FPC Contact,Bottom 10 0.039"（1.00mm） 1.0mm FFC, FPC Connectors RoHS; SuppliersPartNumber: C52162; JLCPCB: NO
P801 = Header 4X2: Header, 4-Pin, Dual row; LatestRevisionDate: 17-Jul-2002; LatestRevisionNote: Re-released for DXP Platform.; Publisher: Altium Limited; JLCPCB: NO
R800 = 0402 1KΩ (1001) 1%: 贴片电阻; ComponentLink1Description: 供应商链接; ComponentLink1URL: http://www.szlcsc.com/product/details_12256.html; Package: 0402; Supplier: LC; SuppliersPartNumber: C11702
R801 R822 = 0402 0Ω (0R0) 1%: 贴片电阻; ComponentLink1Description: 供应商链接; ComponentLink1URL: http://www.szlcsc.com/product/details_17853.html; Package: 0402; Supplier: LC; SuppliersPartNumber: C17168
R802-R804 R806 = 0402 150Ω (1500) 1%: 贴片电阻; ComponentLink1Description: 供应商链接; ComponentLink1URL: http://www.szlcsc.com/product/details_25825.html; Package: 0402; Supplier: LC; SuppliersPartNumber: C25082
R805 R807 R808 R813 R814 R818-R821 = 0402 4.7KΩ (4701) 1%: 贴片电阻; ComponentLink1Description: 供应商链接; ComponentLink1URL: http://www.szlcsc.com/product/details_26643.html; Package: 0402; Supplier: LC; SuppliersPartNumber: C25900
R809-R811 = 0402 49.9Ω (49R9) 1%: 贴片电阻; ComponentLink1Description: 供应商链接; ComponentLink1URL: http://www.szlcsc.com/product/details_25863.html; Package: 0402; Supplier: LC; SuppliersPartNumber: C25120
R812 = 0402 47Ω (47R0) 1%: 贴片电阻; ComponentLink1Description: 供应商链接; ComponentLink1URL: http://www.szlcsc.com/product/details_25861.html; Package: 0402; Supplier: LC; SuppliersPartNumber: C25118
U800 = STM32H743IIT6: ST MICROELECTRONICS LQFP-176_24X24X05P ROHS; SuppliersPartNumber: C89597
U801 U802 = W25Q128JVSIQTR_[C97521]: Flash ROM; ComponentLink1Description: 供应商链接; ComponentLink1URL: https://item.szlcsc.com/98729.html; Package: SOIC-8; Supplier: LC; SuppliersPartNumber: C97521
U803 = BOSC-BMP280-LGA-8: Digital Pressure Sensor, 1.71 to 3.6 V, -40 to 85 degC, 8-Pin LGA, RoHS, Tape and Reel; Manufacturer: Bosch Sensortec; Manufacturer URL: http://www.bosch-sensortec.com; Datasheet URL: http://datasheet.octopart.com/BMP280-Bosch-datasheet-41546027.pdf; Datasheet Version: Rev. 1.14, 05/2015; SuppliersPartNumber: C83291
Y800 = SMD-3225_4P  25MHZ 12PF 10PPM: 贴片晶振; ComponentLink1Description: 供应商链接; ComponentLink1URL: http://www.szlcsc.com/product/details_9526.html; Package: SMD-3225_4P; Supplier: LC; SuppliersPartNumber: C9006
P800 = tag_connect_TC2030: JLCPCB: NO

## Sheet [09] - Ethernet.SchDoc
size A3
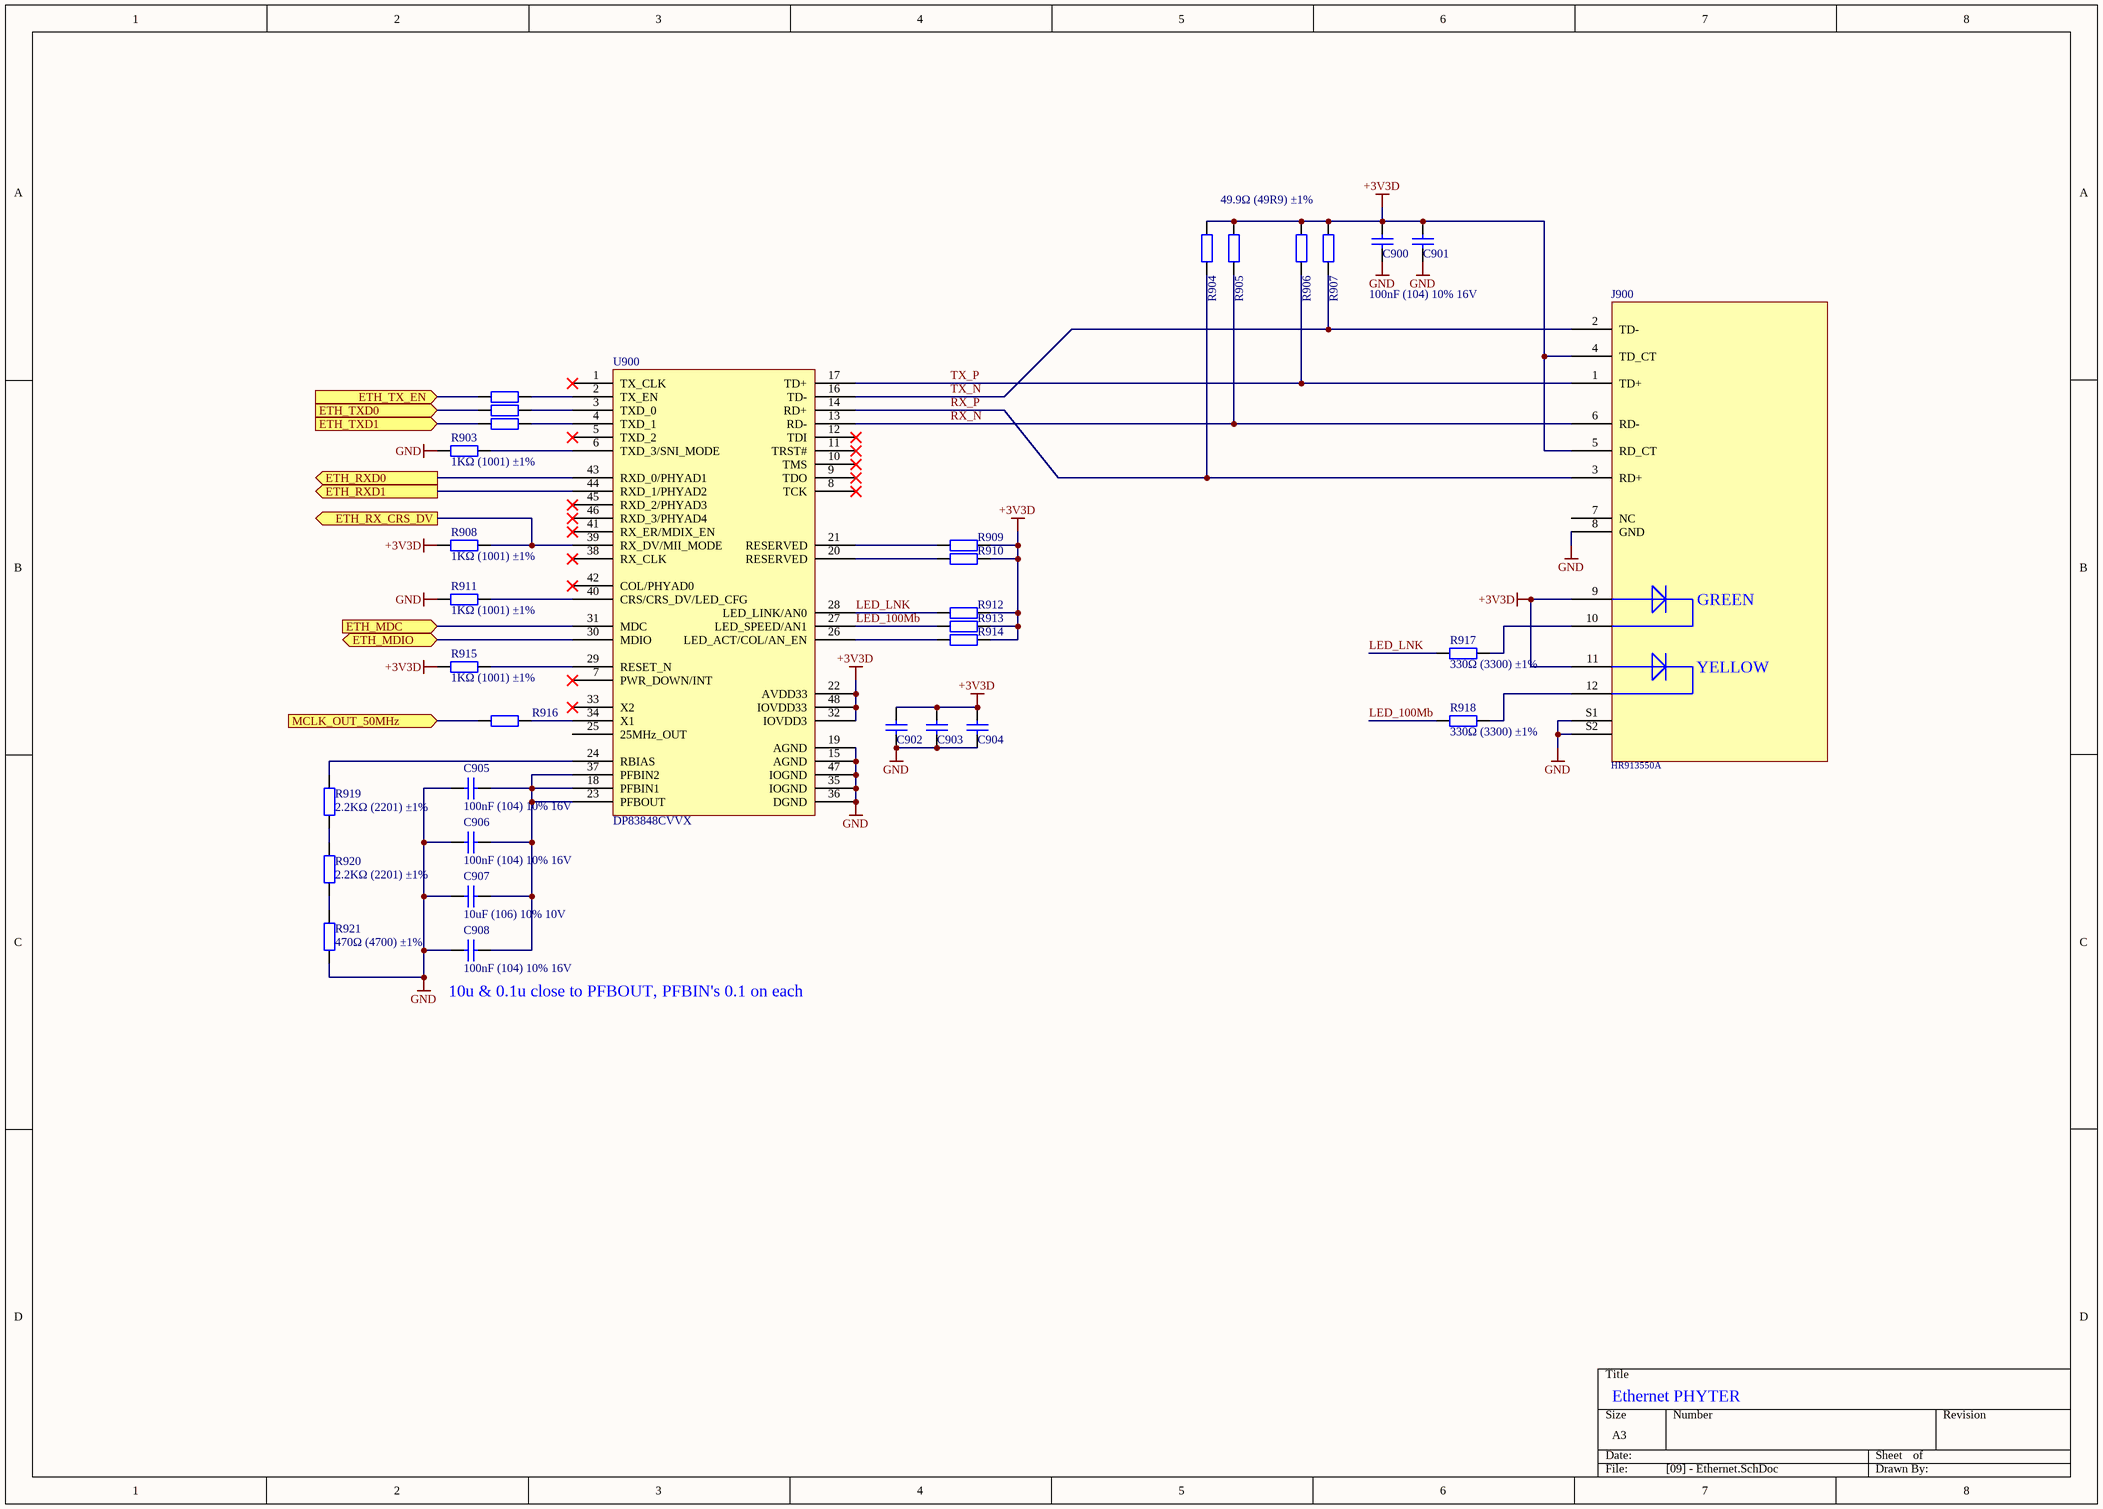
[diagram p6: [09] - Ethernet.SchDoc]

### Parts
C900  100nF (104) 10% 16V  [0402_C]
C901  100nF (104) 10% 16V  [0402_C]  (value not drawn)
C902  100nF (104) 10% 16V  [0402_C]  (value not drawn)
C903  100nF (104) 10% 16V  [0402_C]  (value not drawn)
C904  100nF (104) 10% 16V  [0402_C]  (value not drawn)
C905  100nF (104) 10% 16V  [0402_C]
C906  100nF (104) 10% 16V  [0402_C]
C907  10uF (106) 10% 10V  [0603_C]
C908  100nF (104) 10% 16V  [0402_C]
J900  HR913550A  [RJ45 MagJack]
R900  49.9Ω (49R9) ±1%  [0402_R]  (value not drawn)
R901  49.9Ω (49R9) ±1%  [0402_R]  (value not drawn)
R902  49.9Ω (49R9) ±1%  [0402_R]  (value not drawn)
R903  1KΩ (1001) ±1%  [0402_R]
R904  49.9Ω (49R9) ±1%  [0402_R]  (value not drawn)
R905  49.9Ω (49R9) ±1%  [0402_R]  (value not drawn)
R906  49.9Ω (49R9) ±1%  [0402_R]  (value not drawn)
R907  49.9Ω (49R9) ±1%  [0402_R]
R908  1KΩ (1001) ±1%  [0402_R]
R909  2.2KΩ (2201) ±1%  [0402_R]  (value not drawn)
R910  2.2KΩ (2201) ±1%  [0402_R]  (value not drawn)
R911  1KΩ (1001) ±1%  [0402_R]
R912  2.2KΩ (2201) ±1%  [0402_R]  (value not drawn)
R913  2.2KΩ (2201) ±1%  [0402_R]  (value not drawn)
R914  2.2KΩ (2201) ±1%  [0402_R]  (value not drawn)
R915  1KΩ (1001) ±1%  [0402_R]
R916  49.9Ω (49R9) ±1%  [0402_R]  (value not drawn)
R917  330Ω (3300) ±1%  [0603_R]
R918  330Ω (3300) ±1%  [0603_R]
R919  2.2KΩ (2201) ±1%  [0402_R]
R920  2.2KΩ (2201) ±1%  [0402_R]
R921  470Ω (4700) ±1%  [0402_R]
U900  DP83848CVVX  [LQFP-48_7x7x05P]

### Ports
ETH_MDC (in), ETH_MDIO (bidir), ETH_RX_CRS_DV (out), ETH_RXD0 (out), ETH_RXD1 (out), ETH_TX_EN (in), ETH_TXD0 (in), ETH_TXD1 (in), MCLK_OUT_50MHz (in)

### Nets
+3V3D: C900.2 C901.2 C902.2 C903.2 C904.2 J900.4(TD_CT) J900.5(RD_CT) J900.9 J900.11 R904.2 R905.2 R906.2 R907.2 R908.1 R909.2 R910.2 R912.2 R913.2 R914.2 R915.1 U900.22(AVDD33) U900.32(IOVDD3) U900.48(IOVDD33)
GND: C900.1 C901.1 C902.1 C903.1 C904.1 C905.1 C906.1 C907.1 C908.1 J900.8(GND) J900.S1 J900.S2 R903.1 R911.1 R921.1 U900.15(AGND) U900.19(AGND) U900.35(IOGND) U900.36(DGND) U900.47(IOGND)
LED_100Mb: R913.1 R918.1 U900.27(LED_SPEED/AN1)
LED_LNK: R912.1 R917.1 U900.28(LED_LINK/AN0)
RX_N: J900.6(RD-) R905.1 U900.13(RD-)
RX_P: J900.3(RD+) R904.1 U900.14(RD+)
TX_N: J900.2(TD-) R907.1 U900.16(TD-)
TX_P: J900.1(TD+) R906.1 U900.17(TD+)
NetC905_2: C905.2 C906.2 C907.2 C908.2 U900.18(PFBIN1) U900.23(PFBOUT) U900.37(PFBIN2)
NetJ900_10: J900.10 R917.2
NetJ900_12: J900.12 R918.2
NetR801_1: R916.1 ; port MCLK_OUT_50MHz
NetR809_1: R908.2 U900.39(RX_DV/MII_MODE) ; port ETH_RX_CRS_DV
NetR810_1: U900.43(RXD_0/PHYAD1) ; port ETH_RXD0
NetR811_1: U900.44(RXD_1/PHYAD2) ; port ETH_RXD1
NetR900_1: R900.1 ; port ETH_TX_EN
NetR900_2: R900.2 U900.2(TX_EN)
NetR901_1: R901.1 ; port ETH_TXD0
NetR901_2: R901.2 U900.3(TXD_0)
NetR902_1: R902.1 ; port ETH_TXD1
NetR902_2: R902.2 U900.4(TXD_1)
NetR903_2: R903.2 U900.6(TXD_3/SNI_MODE)
NetR909_1: R909.1 U900.21(RESERVED)
NetR910_1: R910.1 U900.20(RESERVED)
NetR911_2: R911.2 U900.40(CRS/CRS_DV/LED_CFG)
NetR914_1: R914.1 U900.26(LED_ACT/COL/AN_EN)
NetR915_2: R915.2 U900.29(RESET_N)
NetR916_2: R916.2 U900.34(X1)
NetR919_1: R919.1 R920.2
NetR919_2: R919.2 U900.24(RBIAS)
NetR920_1: R920.1 R921.2
NetU800_33: U900.31(MDC) ; port ETH_MDC
NetU800_42: U900.30(MDIO) ; port ETH_MDIO

Not connected (* = marked no-connect by the designer): J900 7(NC); U900 1(TX_CLK)* 5(TXD_2)* 7(PWR_DOWN/INT)* 8(TCK)* 9(TDO)* 10(TMS)* 11(TRST#)* 12(TDI)* 25(25MHz_OUT) 33(X2)* 38(RX_CLK)* 41(RX_ER/MDIX_EN)* 42(COL/PHYAD0)* 45(RXD_2/PHYAD3)* 46(RXD_3/PHYAD4)*

### Notes on the sheet
- (near C908) 10u & 0.1u close to PFBOUT, PFBIN's 0.1 on each
- Ethernet PHYTER
- (in symbol HR913550A) GREEN; YELLOW

### Library data of the parts
C900-C906 C908 = 0402 100nF (104) 10% 16V: 贴片电容; ComponentLink1Description: 供应商链接; ComponentLink1URL: http://www.szlcsc.com/product/details_1877.html; Package: 0402; Supplier: LC; SuppliersPartNumber: C1525
C907 = 0603 10uF (106) 10% 10V: 贴片电容; ComponentLink1Description: 供应商链接; ComponentLink1URL: http://www.szlcsc.com/product/details_20411.html; Package: 0603; Supplier: LC; SuppliersPartNumber: C19702
J900 = HR913550A: RJ45 12 1 Green - Yellow Through Hole Ethernet Connectors/Modular Connectors (RJ45 RJ11) RoHS; JLCPCB: NO; SuppliersPartNumber: C163507
R900-R902 R904-R907 R916 = 0402 49.9Ω (49R9) 1%: 贴片电阻; ComponentLink1Description: 供应商链接; ComponentLink1URL: http://www.szlcsc.com/product/details_25863.html; Package: 0402; Supplier: LC; SuppliersPartNumber: C25120
R903 R908 R911 R915 = 0402 1KΩ (1001) 1%: 贴片电阻; ComponentLink1Description: 供应商链接; ComponentLink1URL: http://www.szlcsc.com/product/details_12256.html; Package: 0402; Supplier: LC; SuppliersPartNumber: C11702
R909 R910 R912-R914 R919 R920 = 0402 2.2KΩ (2201) 1%: 贴片电阻; ComponentLink1Description: 供应商链接; ComponentLink1URL: http://www.szlcsc.com/product/details_26622.html; Package: 0402; Supplier: LC; SuppliersPartNumber: C25879
R917 R918 = 0603 330Ω (3300) 1%: 贴片电阻; ComponentLink1Description: 供应商链接; ComponentLink1URL: http://www.szlcsc.com/product/details_23865.html; Package: 0603; Supplier: LC; SuppliersPartNumber: C23138
R921 = 0402 470Ω (4700) 1%: 贴片电阻; ComponentLink1Description: 供应商链接; ComponentLink1URL: http://www.szlcsc.com/product/details_25860.html; Package: 0402; Supplier: LC; SuppliersPartNumber: C25117
U900 = DP83848CVVX_[C16688]: 接口芯片; ComponentLink1Description: 供应商链接; ComponentLink1URL: http://www.szlcsc.com/product/details_17371.html; Package: LQFP-48_7x7x05P; Supplier: LC; SuppliersPartNumber: C16688

## Sheet [10] - Isolation.SchDoc
size A3
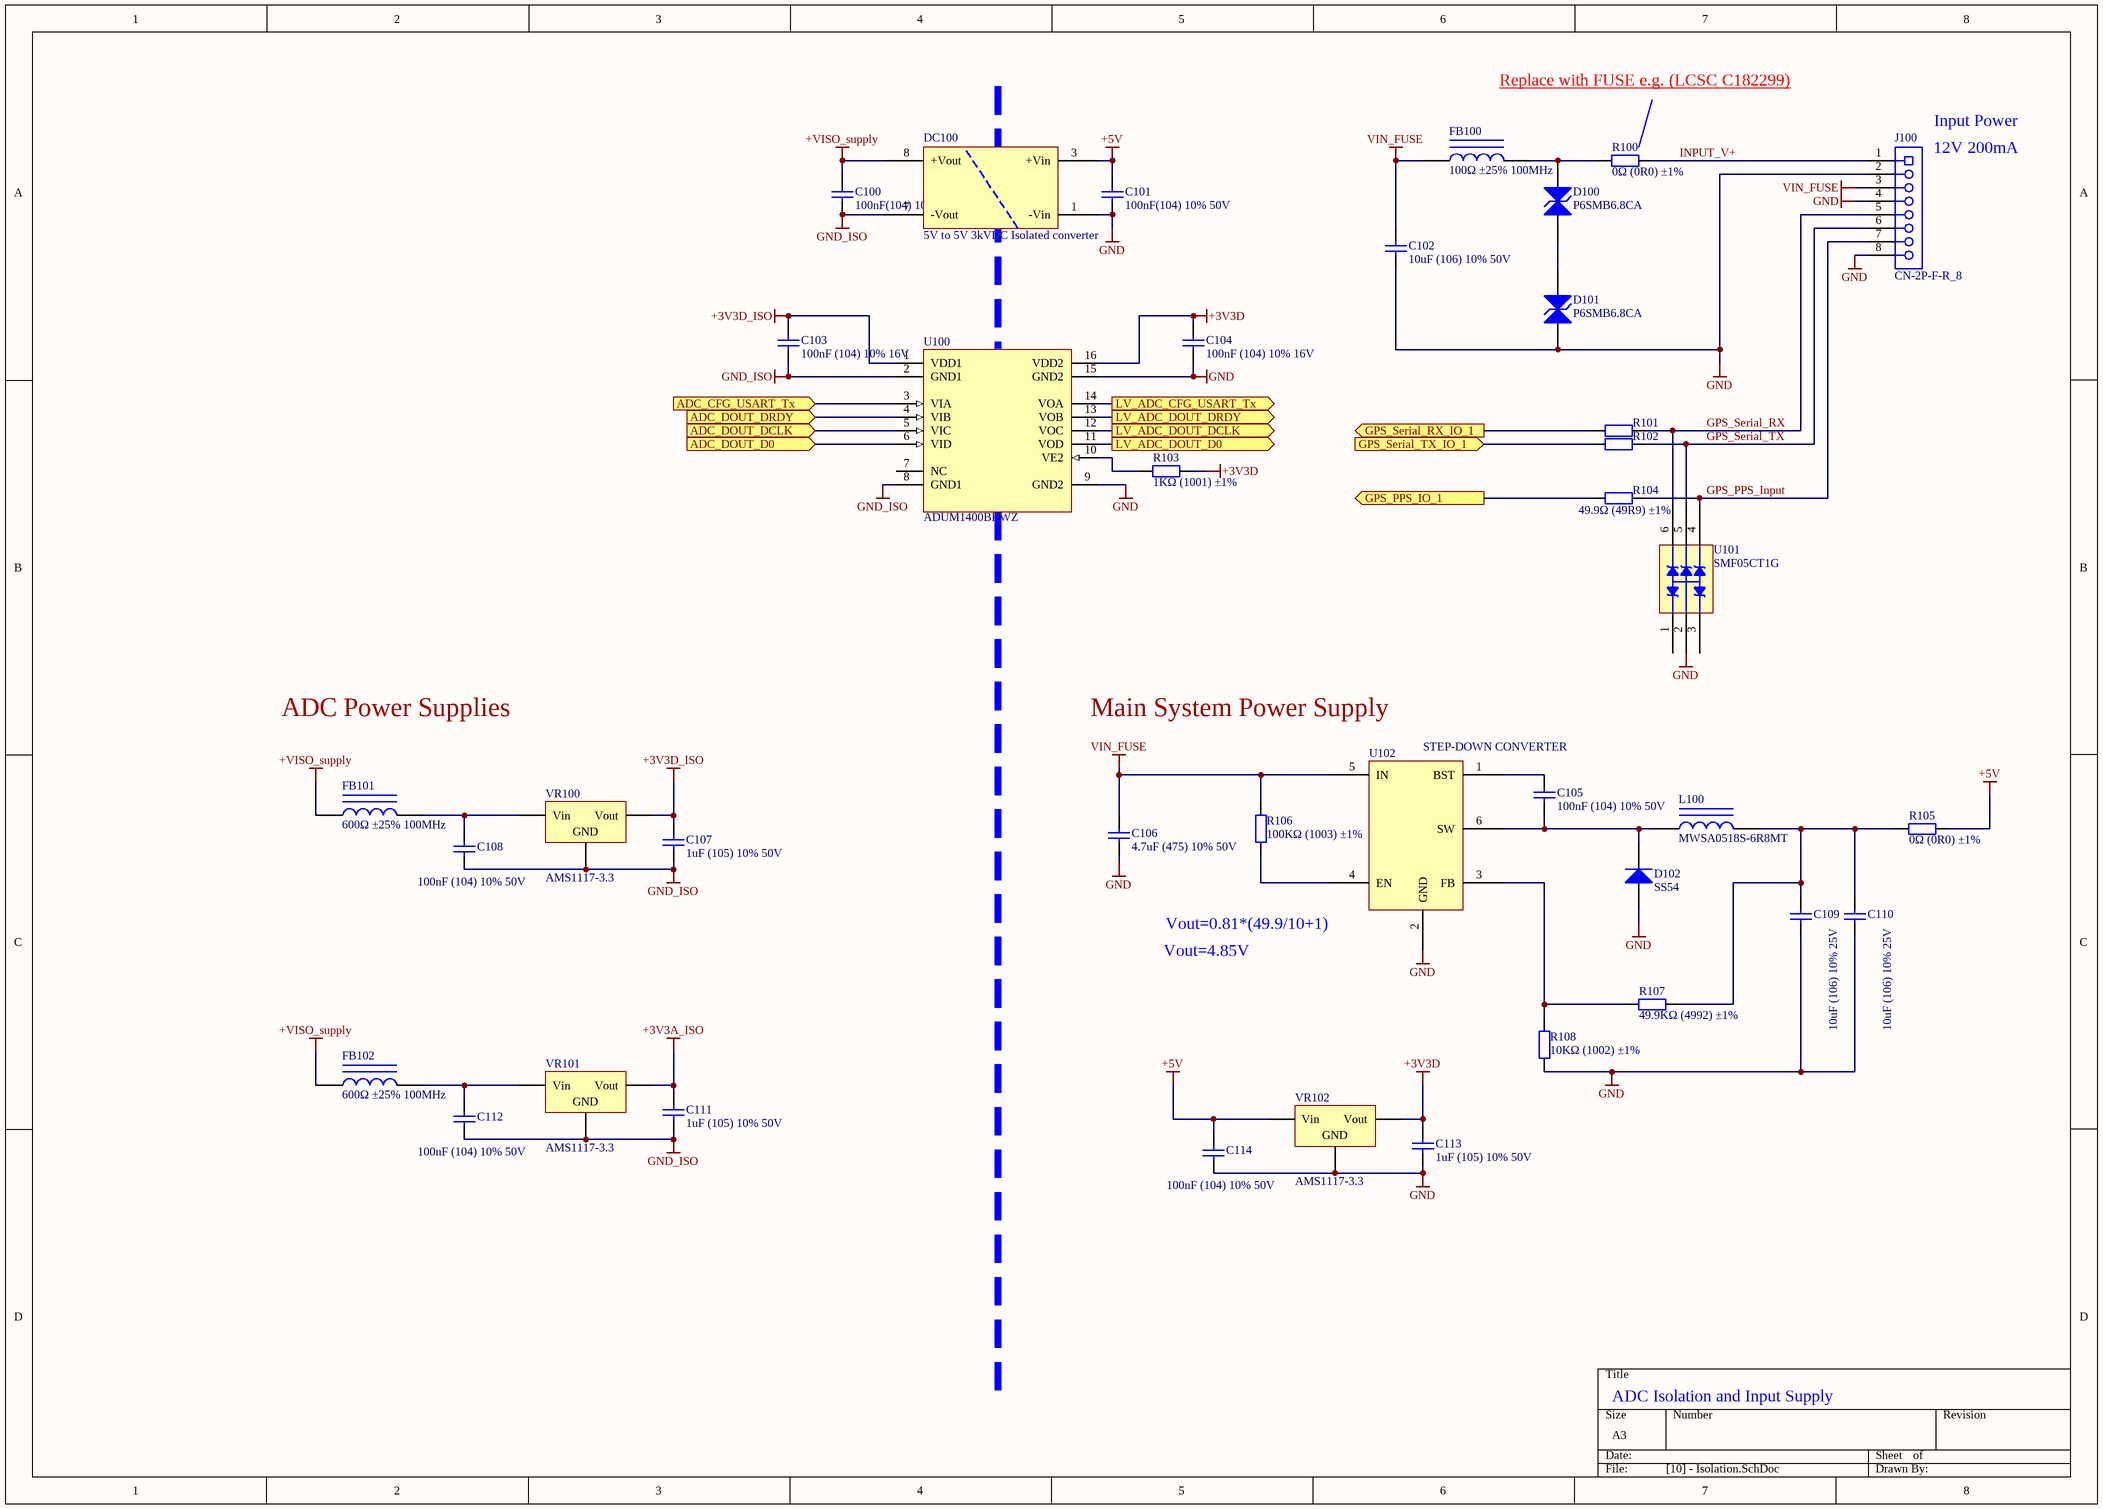
[diagram p7: [10] - Isolation.SchDoc]

### Parts
C100  100nF(104) 10% 50V  [0805_C]
C101  100nF(104) 10% 50V  [0805_C]
C102  10uF (106) 10% 50V  [1206_C]
C103  100nF (104) 10% 16V  [0402_C]
C104  100nF (104) 10% 16V  [0402_C]
C105  100nF (104) 10% 50V  [0603_C]
C106  4.7uF (475) 10% 50V  [1206_C]
C107  1uF (105) 10% 50V  [0603_C]
C108  100nF (104) 10% 50V  [0603_C]
C109  10uF (106) 10% 25V  [0805_C]
C110  10uF (106) 10% 25V  [0805_C]
C111  1uF (105) 10% 50V  [0603_C]
C112  100nF (104) 10% 50V  [0603_C]
C113  1uF (105) 10% 50V  [0603_C]
C114  100nF (104) 10% 50V  [0603_C]
D100  P6SMB6.8CA  [SMB(DO-214AA)_S1]
D101  P6SMB6.8CA  [SMB(DO-214AA)_S1]
D102  SS54  [SMA(DO-214AC)_S1]
DC100  5V to 5V 3kVDC Isolated converter  [NXE1S0505MC-R7]
FB100  100Ω ±25% 100MHz  [0805_L]
FB101  600Ω ±25% 100MHz  [0805_L]
FB102  600Ω ±25% 100MHz  [0805_L]
J100  CN-2P-F-R_8  [PHOE-8way]
L100  MWSA0518S-6R8MT  [MWSA0518]
R100  0Ω (0R0) ±1%  [0603_R]
R101  49.9Ω (49R9) ±1%  [0402_R]  (value not drawn)
R102  49.9Ω (49R9) ±1%  [0402_R]  (value not drawn)
R103  1KΩ (1001) ±1%  [0402_R]
R104  49.9Ω (49R9) ±1%  [0402_R]
R105  0Ω (0R0) ±1%  [0805_R]
R106  100KΩ (1003) ±1%  [0402_R]
R107  49.9KΩ (4992) ±1%  [0402_R]
R108  10KΩ (1002) ±1%  [0402_R]
U100  ADUM1400BRWZ  [ADI-RW-16_L]
U101  SMF05CT1G  [SC-70-6(SOT-363)]
U102  STEP-DOWN CONVERTER  [*TSOT-23_S6]
VR100  AMS1117-3.3  [SOT-223]
VR101  AMS1117-3.3  [SOT-223]
VR102  AMS1117-3.3  [SOT-223]

### Ports
ADC_CFG_USART_Tx (in), ADC_DOUT_D0 (in), ADC_DOUT_DCLK (in), ADC_DOUT_DRDY (in), GPS_PPS_IO_1 (out), GPS_Serial_RX_IO_1 (out), GPS_Serial_TX_IO_1 (in), LV_ADC_CFG_USART_Tx (out), LV_ADC_DOUT_D0 (out), LV_ADC_DOUT_DCLK (out), LV_ADC_DOUT_DRDY (out)

### Nets
+3V3A_ISO: C111.2 VR101.2(Vout)
+3V3D: C104.2 C113.2 R103.2 U100.16(VDD2) VR102.2(Vout)
+3V3D_ISO: C103.2 C107.2 U100.1(VDD1) VR100.2(Vout)
+5V: C101.2 C114.2 DC100.3(+Vin) R105.2 VR102.3(Vin)
+VISO_supply: C100.2 DC100.8(+Vout) FB101.1 FB102.1
GND: C101.1 C102.1 C104.1 C106.1 C109.1 C110.1 C113.1 C114.1 D101.1(A) D102.1(A) DC100.1(-Vin) J100.2 J100.4 J100.8 R108.2 U100.9(GND2) U100.15(GND2) U101.2 U102.2(GND) VR102.1(GND)
GND_ISO: C100.1 C103.1 C107.1 C108.1 C111.1 C112.1 DC100.7(-Vout) U100.2(GND1) U100.8(GND1) VR100.1(GND) VR101.1(GND)
VIN_FUSE: C102.2 C106.2 FB100.1 J100.3 R106.2 U102.5(IN)
GPS_PPS_Input: J100.7 R104.2 U101.4
GPS_Serial_RX: J100.5 R101.2 U101.6
GPS_Serial_TX: J100.6 R102.2 U101.5
INPUT_V+: J100.1 R100.2
NetC105_1: C105.1 D102.2(K) L100.1 U102.6(SW)
NetC105_2: C105.2 U102.1(BST)
NetC108_2: C108.2 FB101.2 VR100.3(Vin)
NetC109_2: C109.2 C110.2 L100.2 R105.1 R107.2
NetC112_2: C112.2 FB102.2 VR101.3(Vin)
NetD100_1: D100.1(A) D101.2(K)
NetD100_2: D100.2(K) FB100.2 R100.1
NetR101_1: R101.1 ; port GPS_Serial_RX_IO_1
NetR102_1: R102.1 ; port GPS_Serial_TX_IO_1
NetR103_1: R103.1 U100.10(VE2)
NetR104_1: R104.1 ; port GPS_PPS_IO_1
NetR106_1: R106.1 U102.4(EN)
NetR107_1: R107.1 R108.1 U102.3(FB)
NetU100_3: U100.3(VIA) ; port ADC_CFG_USART_Tx
NetU100_4: U100.4(VIB) ; port ADC_DOUT_DRDY
NetU100_5: U100.5(VIC) ; port ADC_DOUT_DCLK
NetU100_6: U100.6(VID) ; port ADC_DOUT_D0
NetU100_11: U100.11(VOD) ; port LV_ADC_DOUT_D0
NetU100_12: U100.12(VOC) ; port LV_ADC_DOUT_DCLK
NetU100_13: U100.13(VOB) ; port LV_ADC_DOUT_DRDY
NetU100_14: U100.14(VOA) ; port LV_ADC_CFG_USART_Tx

Not connected (* = marked no-connect by the designer): U100 7(NC); U101 1 3

### Notes on the sheet
- Replace with FUSE e.g. (LCSC C182299)
- (near J100) Input Power
- (near J100) 12V 200mA
- ADC Power Supplies
- (near U102) Main System Power Supply
- (near U102) Vout=0.81*(49.9/10+1)
- Vout=4.85V
- ADC Isolation and Input Supply

### Library data of the parts
C100 C101 = 0805 100nF(104) 10% 50V: 贴片电容; ComponentLink1Description: 供应商链接; ComponentLink1URL: http://www.szlcsc.com/product/details_50686.html; Package: 0805; Supplier: LC; SuppliersPartNumber: C49678
C102 = 1206 10uF (106) 10% 50V: 贴片电容; ComponentLink1Description: 供应商链接; ComponentLink1URL: http://www.szlcsc.com/product/details_14236.html; Package: 1206; Supplier: LC; SuppliersPartNumber: C13585
C103 C104 = 0402 100nF (104) 10% 16V: 贴片电容; ComponentLink1Description: 供应商链接; ComponentLink1URL: http://www.szlcsc.com/product/details_1877.html; Package: 0402; Supplier: LC; SuppliersPartNumber: C1525
C105 C108 C112 C114 = 0603 100nF (104) 10% 50V: 贴片电容; ComponentLink1Description: 供应商链接; ComponentLink1URL: http://www.szlcsc.com/product/details_15331.html; Package: 0603; Supplier: LC; SuppliersPartNumber: C14663
C106 = 1206 4.7uF (475) 10% 50V: 贴片电容; ComponentLink1Description: 供应商链接; ComponentLink1URL: http://www.szlcsc.com/product/details_30577.html; Package: 1206; Supplier: LC; SuppliersPartNumber: C29823
C107 C111 C113 = 0603 1uF (105) 10% 50V: 贴片电容; ComponentLink1Description: 供应商链接; ComponentLink1URL: http://www.szlcsc.com/product/details_16531.html; Package: 0603; Supplier: LC; SuppliersPartNumber: C15849
C109 C110 = 0805 10uF (106) 10% 25V: 贴片电容; ComponentLink1Description: 供应商链接; ComponentLink1URL: http://www.szlcsc.com/product/details_16532.html; Package: 0805; Supplier: LC; SuppliersPartNumber: C15850
D100 D101 = SMB/DO-214AA P6SMB6.8CA: TVS; ComponentLink1Description: 供应商链接; ComponentLink1URL: http://www.szlcsc.com/product/details_79530.html; Package: SMB/DO-214AA; Supplier: LC; SuppliersPartNumber: C78395
D102 = SMA(DO-214AC) SS54: 二极管; ComponentLink1Description: 供应商链接; ComponentLink1URL: http://www.szlcsc.com/product/details_23178.html; Package: SMA(DO-214AC); Supplier: LC; SuppliersPartNumber: C22452
DC100 = NXE1S0505MC-R7: NXE1 1W Isolated DC-DC Converter Surface Mount, Voltage in 4.5 → 5.5 V dc; JLCPCB: NO
FB100 = 0805 100Ω 25% 100MHz: 贴片磁珠; ComponentLink1Description: 供应商链接; ComponentLink1URL: http://www.szlcsc.com/product/details_1367.html; Package: 0805; Supplier: LC; SuppliersPartNumber: C1015
FB101 FB102 = 0805 600Ω 25% 100MHz: 贴片磁珠; ComponentLink1Description: 供应商链接; ComponentLink1URL: http://www.szlcsc.com/product/details_1369.html; Package: 0805; Supplier: LC; SuppliersPartNumber: C1017
J100 = CN-2P-F-R_8: 8way - 5.08 block; JLCPCB: NO
L100 = MWSA0518S-6R8MT: POWER INDUCTORS SMD,5.2X5.4X1.8MM ROHS; Value: 6.8uH; Current Rating: 5.0A; Package: 5.2X5.4X1.8MM; Supplier: LC; SuppliersPartNumber: C408348; ClassName: PowerPads
R100 = 0603 0Ω (0R0) 1%: 贴片电阻; ComponentLink1Description: 供应商链接; ComponentLink1URL: http://www.szlcsc.com/product/details_21903.html; Package: 0603; Supplier: LC; SuppliersPartNumber: C21189
R101 R102 R104 = 0402 49.9Ω (49R9) 1%: 贴片电阻; ComponentLink1Description: 供应商链接; ComponentLink1URL: http://www.szlcsc.com/product/details_25863.html; Package: 0402; Supplier: LC; SuppliersPartNumber: C25120
R103 = 0402 1KΩ (1001) 1%: 贴片电阻; ComponentLink1Description: 供应商链接; ComponentLink1URL: http://www.szlcsc.com/product/details_12256.html; Package: 0402; Supplier: LC; SuppliersPartNumber: C11702
R105 = 0805 0Ω (0R0) 1%: 贴片电阻; ComponentLink1Description: 供应商链接; ComponentLink1URL: http://www.szlcsc.com/product/details_18165.html; Package: 0805; Supplier: LC; SuppliersPartNumber: C17477
R106 = 0402 100KΩ (1003) 1%: 贴片电阻; ComponentLink1Description: 供应商链接; ComponentLink1URL: http://www.szlcsc.com/product/details_26484.html; Package: 0402; Supplier: LC; SuppliersPartNumber: C25741
R107 = 0402 49.9KΩ (4992) 1%: 贴片电阻; ComponentLink1Description: 供应商链接; ComponentLink1URL: http://www.szlcsc.com/product/details_26640.html; Package: 0402; Supplier: LC; SuppliersPartNumber: C25897
R108 = 0402 10KΩ (1002) 1%: 贴片电阻; ComponentLink1Description: 供应商链接; ComponentLink1URL: http://www.szlcsc.com/product/details_26487.html; Package: 0402; Supplier: LC; SuppliersPartNumber: C25744
U100 = ADI-ADUMX400-RX-16: Quad Channel Digital Isolator, 2.5 KV rms Insulation Rating, 10 Mbps Data Rate, 50 ns Delay, Industrial, 16-pin SOIC (RW-16), Tube; Manufacturer: Analog Devices; Max Data Rate: 10Mbps; Insulation Rating (kVrms): 2.5; Mounting Technology: Surface Mount; ComponentLink5Description: URL Link2; PackageReference: RW-16; ComponentLink3Description: Package Specification; Code_JEDEC: MS-013-AA; PartNumber: ADUM1400BRWZ; DatasheetVersion: Rev. H; ComponentLink2Description: Datasheet; ComponentLink4Description: URL Link1; ComponentLink1URL: http://www.analog.com/en/index.html; PackageVersion: 032707-B, 03/2007; Max Operating Temp (degreesC): 125; PackageDescription: 16-Pin Standard Small Outline Package, Body 10.3 x 7.5 mm, Pitch 1.27 mm; ComponentLink1Description: Manufacturer URL; ComponentLink5URL: Reference Circuit:http://www.analog.com/en/interface-isolation/digital-isolators/adum1400/products/product.html#product-recommendations; ComponentLink2URL: http://www.analog.com/static/imported-files/data_sheets/ADuM1400_1401_1402.pdf; ComponentLink4URL: Product URL:http://www.analog.com/en/interface-isolation/digital-isolators/adum1400/products/product.html; ComponentLink3URL: http://www.analog.com/static/imported-files/packages/PKG_PDF/SOIC_WIDE%20%28RW%29/RW_16.pdf; SuppliersPartNumber: C72910
U101 = SMF05CT1G_[C15879]: TVS; ComponentLink1Description: 供应商链接; ComponentLink1URL: http://www.szlcsc.com/product/details_16561.html; Package: SC-70-6(SOT-363); Supplier: LC; SuppliersPartNumber: C15879
U102 = MP2359: 1.2A, 24V, 1.4MHz STEP-DOWN CONVERTER IN A TSOT23-6; SuppliersPartNumber: C14259; ClassName: PowerPads
VR100-VR102 = SOT-223 AMS1117-3.3: 低压差线性稳压(LDO); ComponentLink1Description: 供应商链接; ComponentLink1URL: http://www.szlcsc.com/product/details_6652.html; Package: SOT-223; Supplier: LC; SuppliersPartNumber: C6186

## Nets that join several sheets
+3V3A_ISO: [05] - ADC (16 pins), [10] - Isolation (C111.2 VR101.2)
+3V3D: [08] - Microcontroller (53 pins), [09] - Ethernet (23 pins), [10] - Isolation (5 pins)
+3V3D_ISO: [05] - ADC (13 pins), [10] - Isolation (C103.2 C107.2 U100.1 VR100.2)
ADC-VCM: [03] - HV Input (13 pins), [04] - Current Transformers (16 pins), [05] - ADC (8 pins)
GND: [08] - Microcontroller (55 pins), [09] - Ethernet (20 pins), [10] - Isolation (20 pins)
GND_ISO: [05] - ADC (43 pins), [10] - Isolation (11 pins)
NetC300_2: [03] - HV Input (C300.2 R301.2 R302.2), [05] - ADC (U500.37)
NetC301_2: [03] - HV Input (C301.2 R304.2 R305.2), [05] - ADC (U500.39)
NetC302_2: [03] - HV Input (C302.2 R307.2 R308.2), [05] - ADC (U500.45)
NetC303_2: [03] - HV Input (C303.2 R310.2 R311.2), [05] - ADC (U500.47)
NetC400_2: [04] - Current Transformers (C400.2 R400.1), [05] - ADC (U500.12)
NetC401_1: [04] - Current Transformers (C401.1 R403.1), [05] - ADC (U500.11)
NetC402_2: [04] - Current Transformers (C402.2 R404.1), [05] - ADC (U500.10)
NetC403_1: [04] - Current Transformers (C403.1 R407.1), [05] - ADC (U500.9)
NetC404_2: [04] - Current Transformers (C404.2 R408.1), [05] - ADC (U500.4)
NetC405_1: [04] - Current Transformers (C405.1 R411.1), [05] - ADC (U500.3)
NetC406_2: [04] - Current Transformers (C406.2 R412.1), [05] - ADC (U500.2)
NetC407_1: [04] - Current Transformers (C407.1 R415.1), [05] - ADC (U500.1)
NetR101_1: [08] - Microcontroller (U800.95), [10] - Isolation (R101.1)
NetR102_1: [08] - Microcontroller (U800.94), [10] - Isolation (R102.1)
NetR104_1: [08] - Microcontroller (U800.87), [10] - Isolation (R104.1)
NetR801_1: [08] - Microcontroller (R801.1 U800.118), [09] - Ethernet (R916.1)
NetR809_1: [08] - Microcontroller (R809.1), [09] - Ethernet (R908.2 U900.39)
NetR810_1: [08] - Microcontroller (R810.1), [09] - Ethernet (U900.43)
NetR811_1: [08] - Microcontroller (R811.1), [09] - Ethernet (U900.44)
NetR900_1: [08] - Microcontroller (U800.80), [09] - Ethernet (R900.1)
NetR901_1: [08] - Microcontroller (U800.92), [09] - Ethernet (R901.1)
NetR902_1: [08] - Microcontroller (U800.93), [09] - Ethernet (R902.1)
NetU100_3: [05] - ADC (U502.8), [10] - Isolation (U100.3)
NetU100_4: [05] - ADC (U500.30), [10] - Isolation (U100.4)
NetU100_5: [05] - ADC (U500.29), [10] - Isolation (U100.5)
NetU100_6: [05] - ADC (U500.28), [10] - Isolation (U100.6)
NetU100_11: [08] - Microcontroller (U800.162), [10] - Isolation (U100.11)
NetU100_12: [08] - Microcontroller (U800.139), [10] - Isolation (U100.12)
NetU100_13: [08] - Microcontroller (U800.70 U800.89), [10] - Isolation (U100.13)
NetU100_14: [08] - Microcontroller (U800.96), [10] - Isolation (U100.14)
NetU800_33: [08] - Microcontroller (U800.33), [09] - Ethernet (U900.31)
NetU800_42: [08] - Microcontroller (U800.42), [09] - Ethernet (U900.30)